# Altium project MCH_MAIN.PrjPcb (part 4 of 7)

## Sheet MB_main_FPGA.SchDoc
size A1
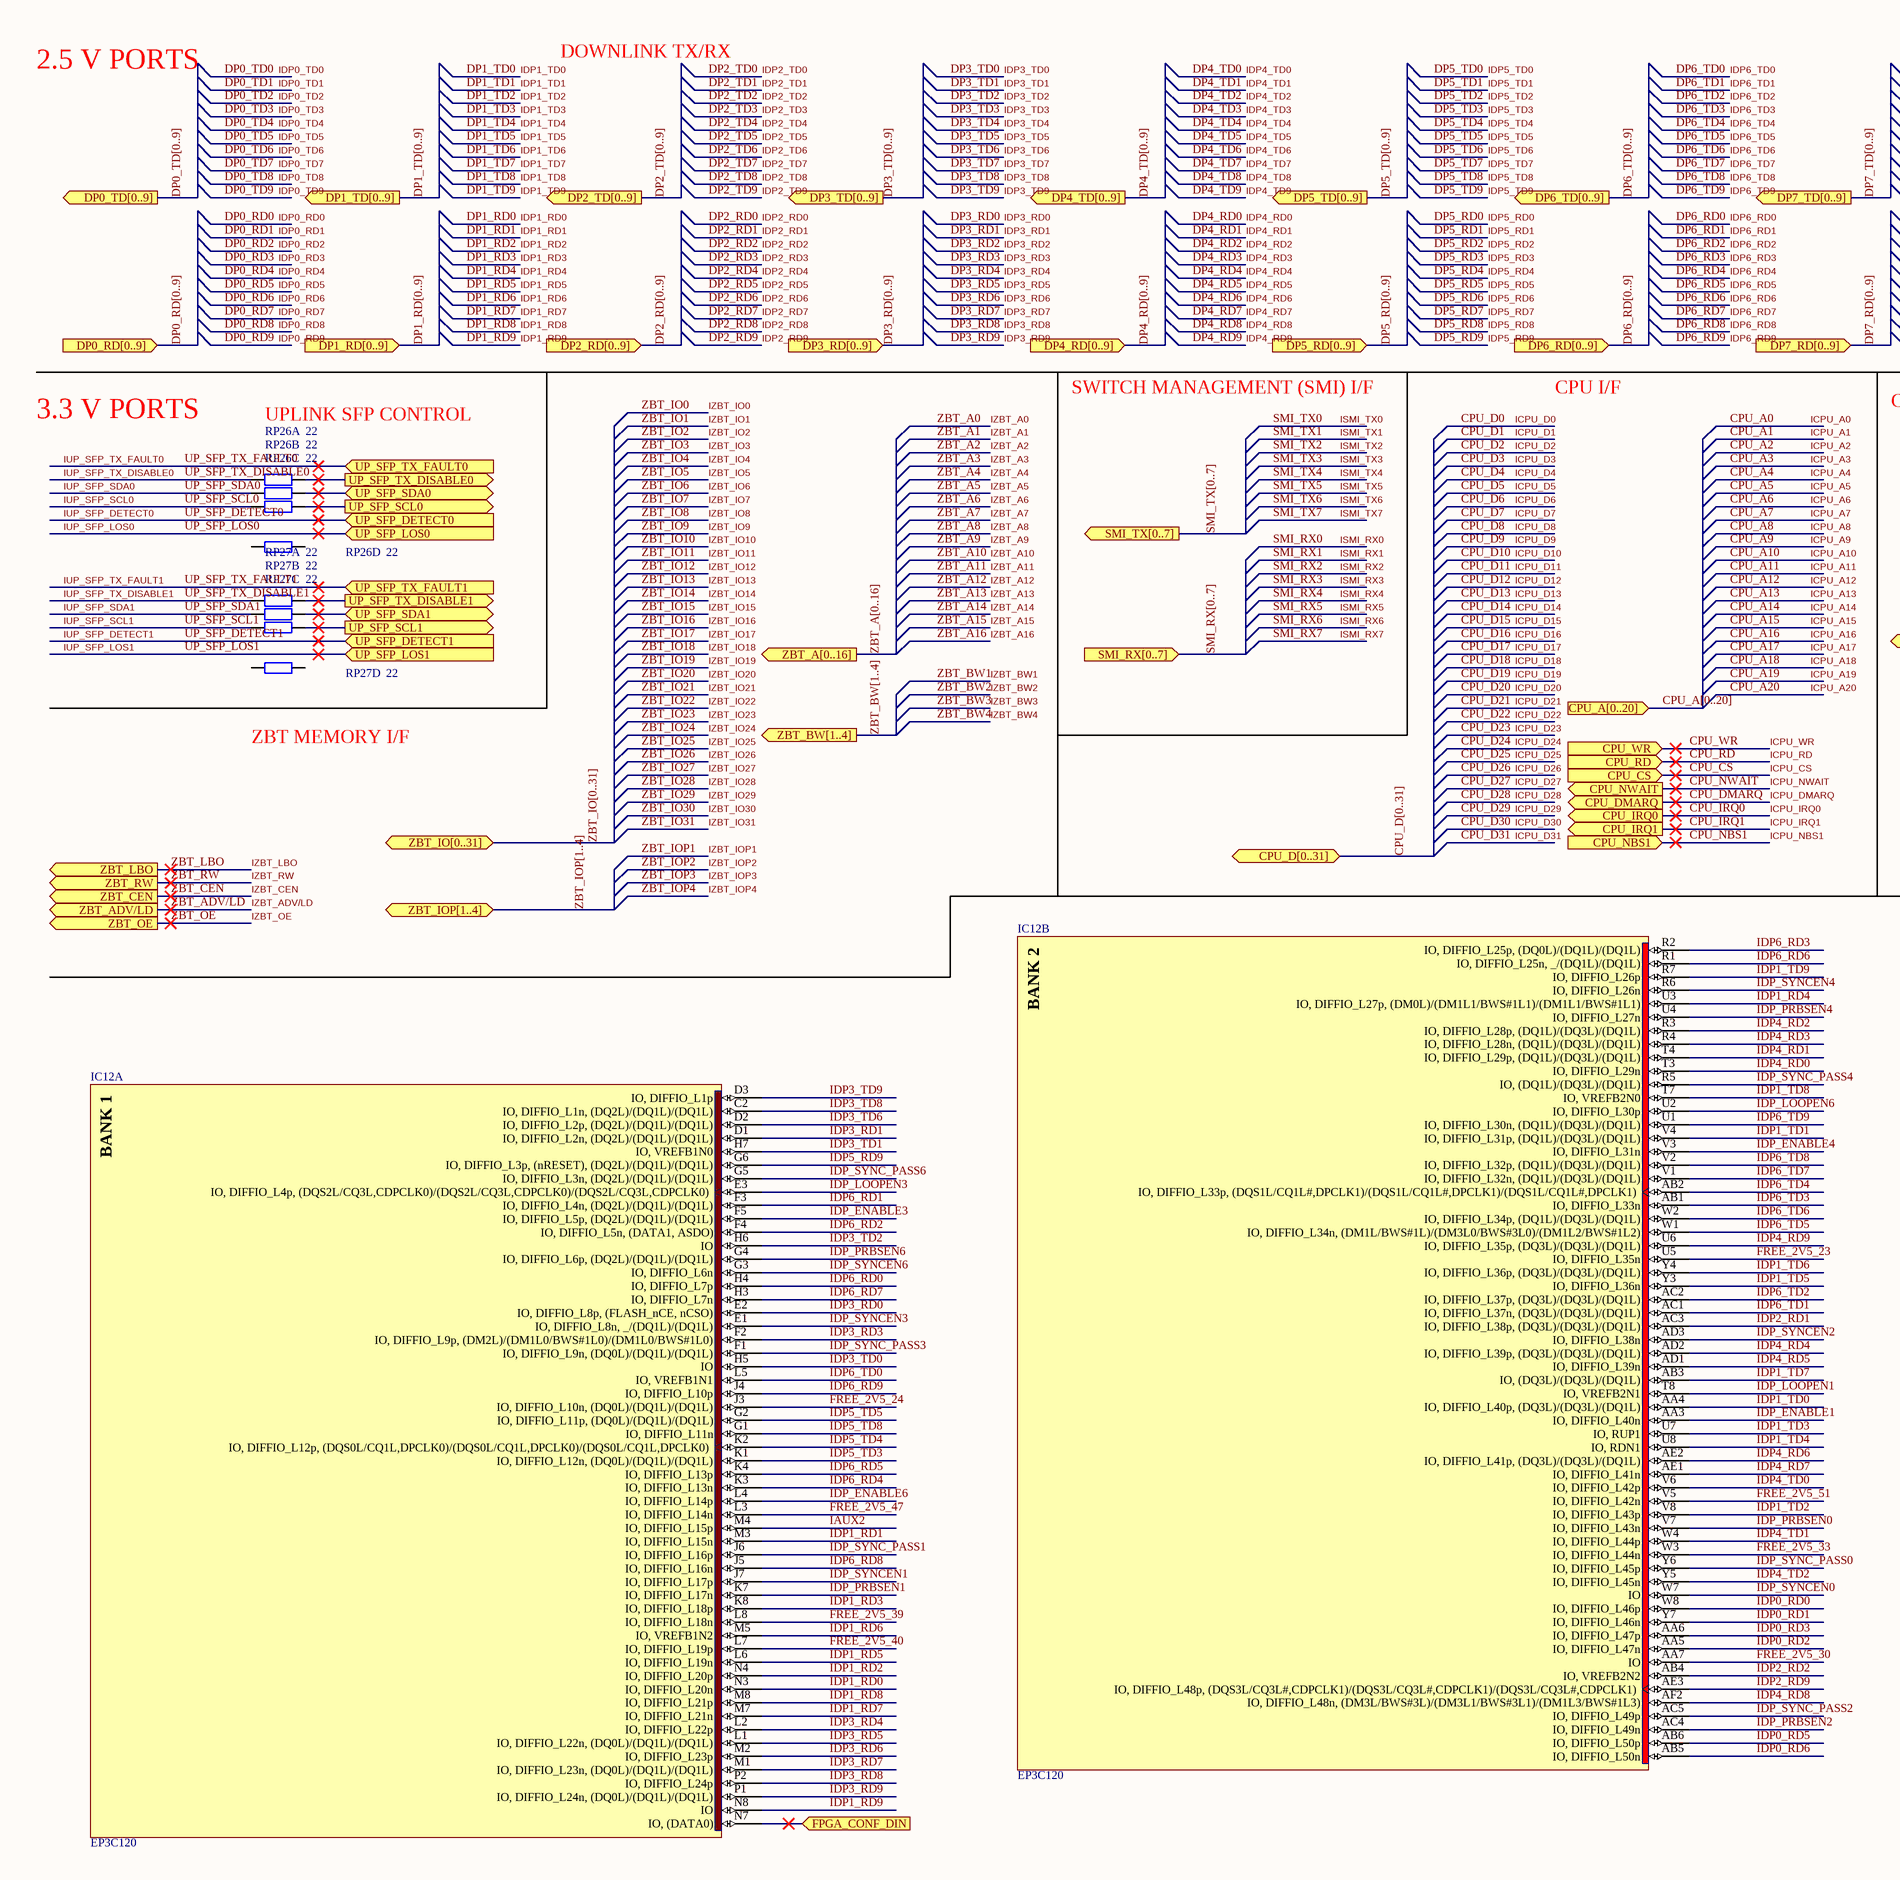
[diagram p8: MB_main_FPGA.SchDoc, top left]
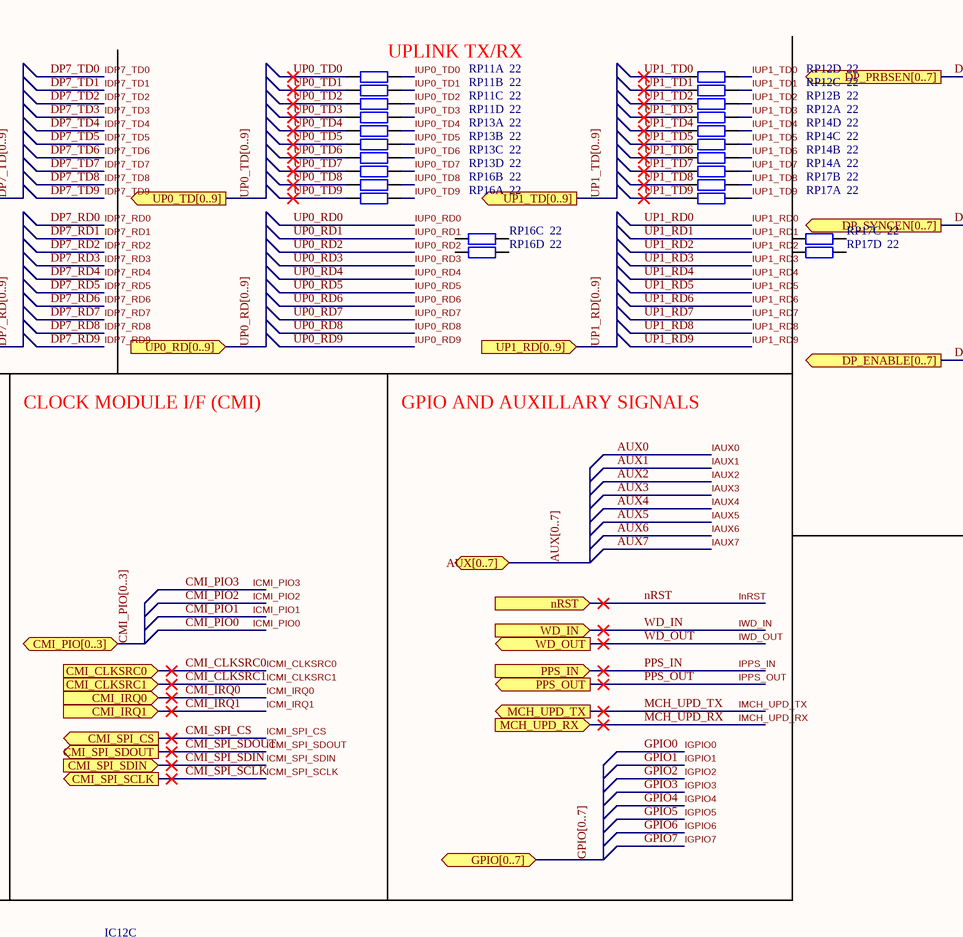
[diagram p9: MB_main_FPGA.SchDoc, top middle]
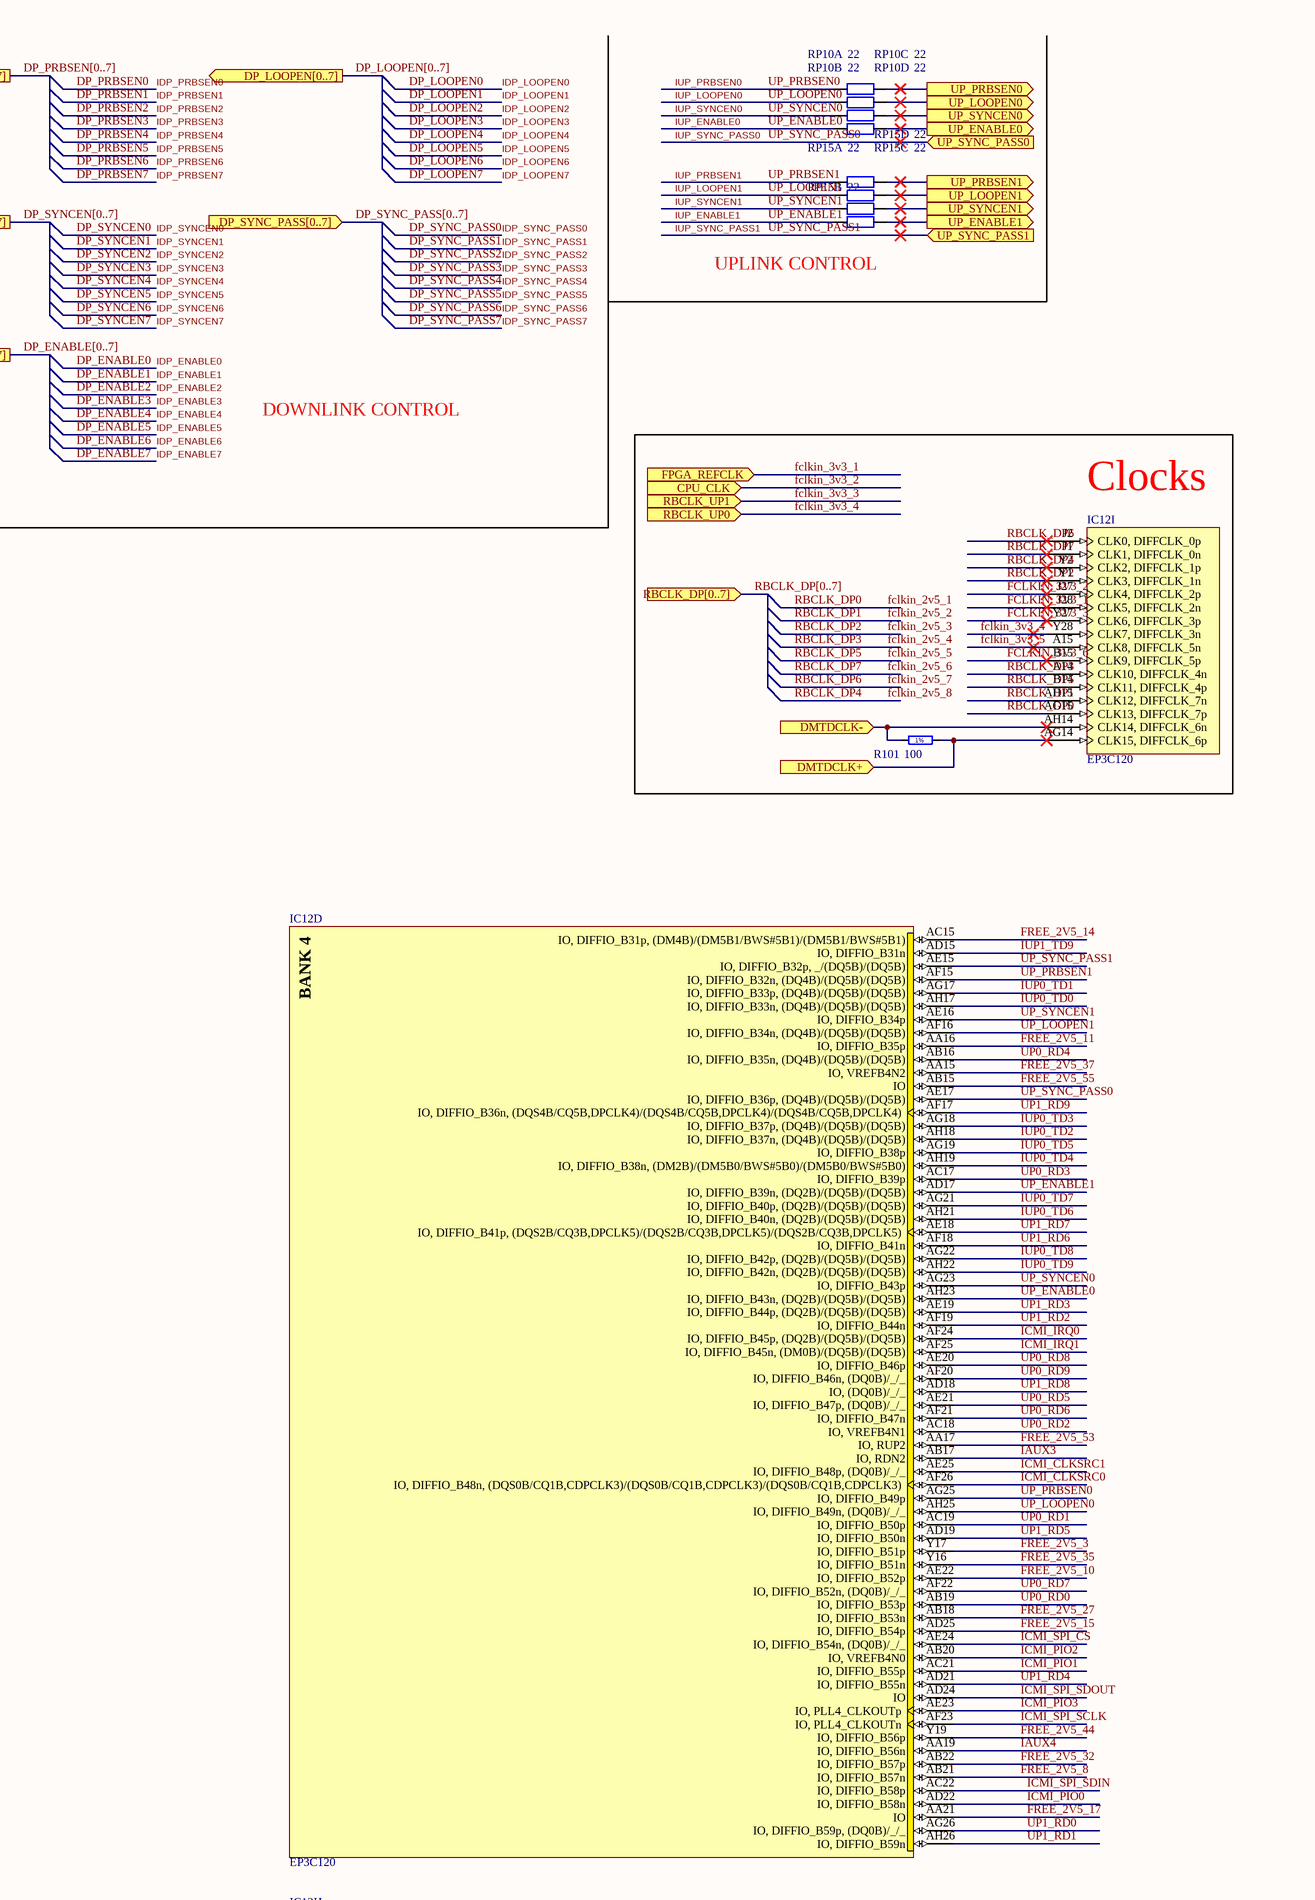
[diagram p10: MB_main_FPGA.SchDoc, top right]
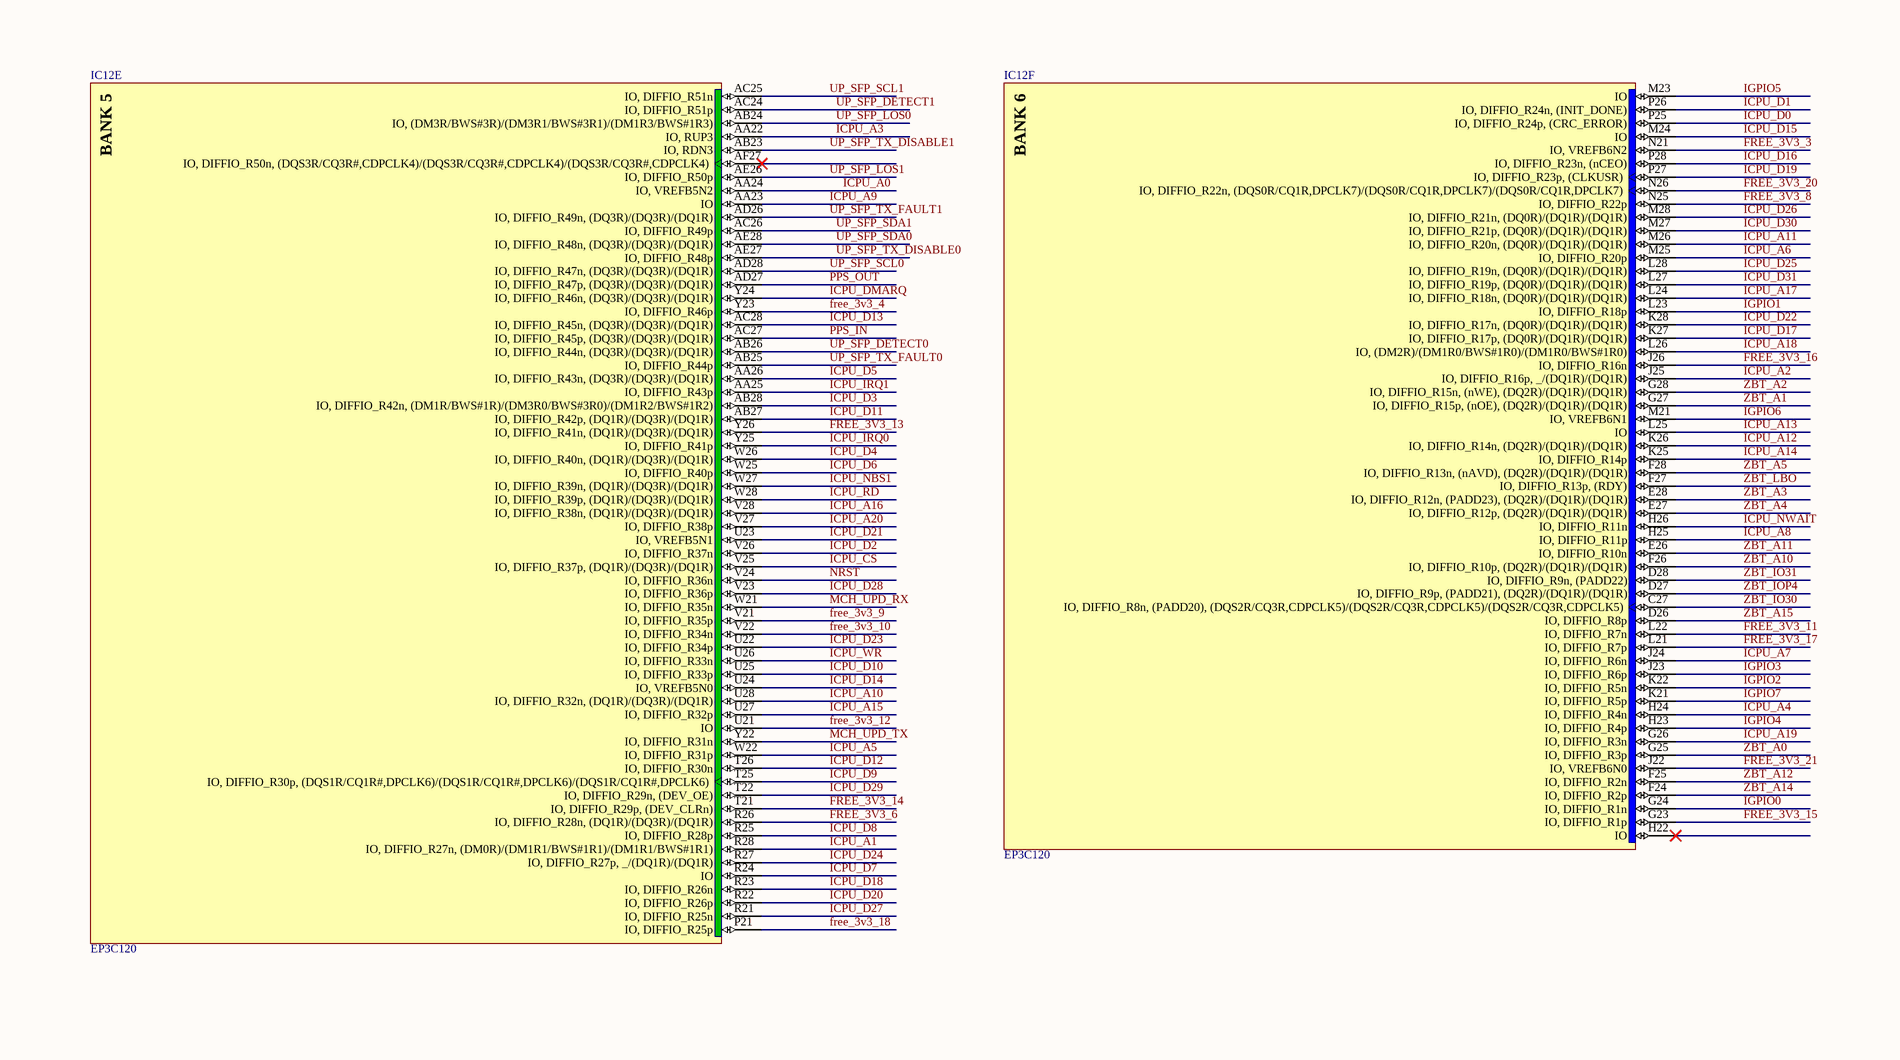
[diagram p11: MB_main_FPGA.SchDoc, bottom left]
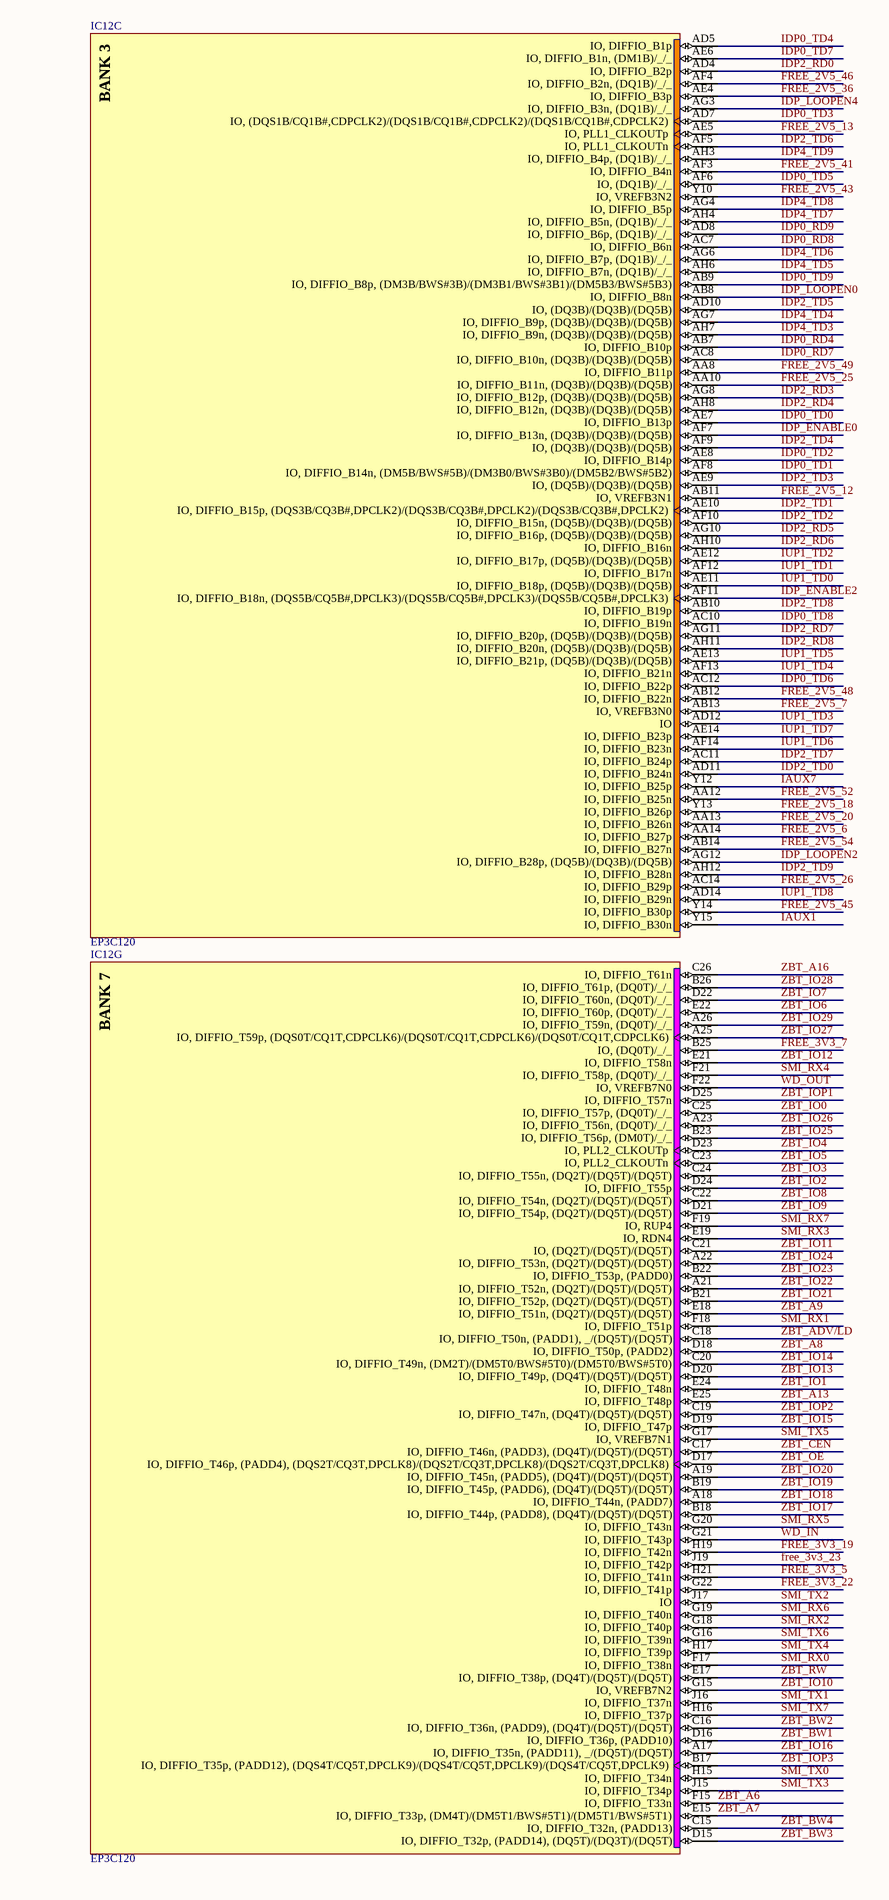
[diagram p12: MB_main_FPGA.SchDoc, bottom middle]
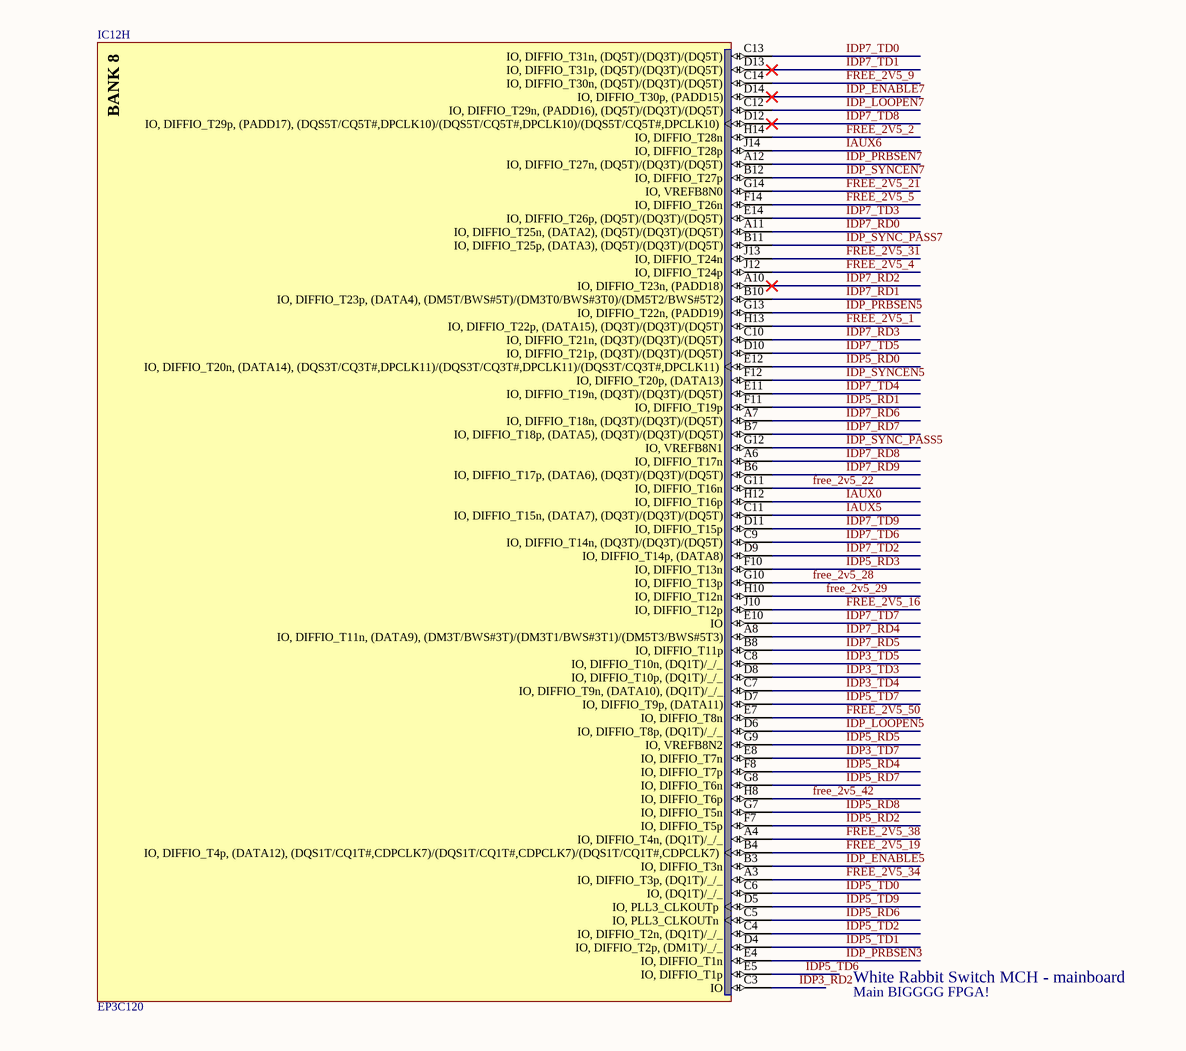
[diagram p13: MB_main_FPGA.SchDoc, bottom right]

### Parts
IC12  EP3C120  [FBGA780-2]  (parts A,B,C,D,E,F,G,H,I of 13)
R101  100  [RESC1005X40N]
RP10  value 22  [YC124]  (hidden comment: RES_PACK)  (parts A,B,C,D of 4)
RP11  value 22  [YC124]  (hidden comment: RES_PACK)  (parts A,B,C,D of 4)
RP12  value 22  [YC124]  (hidden comment: RES_PACK)  (parts A,B,C,D of 4)
RP13  value 22  [YC124]  (hidden comment: RES_PACK)  (parts A,B,C,D of 4)
RP14  value 22  [YC124]  (hidden comment: RES_PACK)  (parts A,B,C,D of 4)
RP15  value 22  [YC124]  (hidden comment: RES_PACK)  (parts A,B,C,D of 4)
RP16  value 22  [YC124]  (hidden comment: RES_PACK)  (parts A,B,C,D of 4)
RP17  value 22  [YC124]  (hidden comment: RES_PACK)  (parts A,B,C,D of 4)
RP26  value 22  [YC124]  (hidden comment: RES_PACK)  (parts A,B,C,D of 4)
RP27  value 22  [YC124]  (hidden comment: RES_PACK)  (parts A,B,C,D of 4)

### Blocks framed on the sheet
Clocks: IC12 R101

### Ports
AUX[0..7] (bidir), CMI_CLKSRC0 (in), CMI_CLKSRC1 (in), CMI_IRQ0 (in), CMI_IRQ1 (in), CMI_PIO[0..3] (bidir), CMI_SPI_CS (out), CMI_SPI_SCLK (out), CMI_SPI_SDIN (in), CMI_SPI_SDOUT (out), CPU_A[0..20] (in), CPU_CLK (in), CPU_CS (in), CPU_D[0..31] (bidir), CPU_DMARQ (out), CPU_IRQ0 (out), CPU_IRQ1 (out), CPU_NBS1 (in), CPU_NWAIT (out), CPU_RD (in), CPU_WR (in), DMTDCLK+ (in), DMTDCLK- (in), DP0_RD[0..9] (in), DP0_TD[0..9] (out), DP1_RD[0..9] (in), DP1_TD[0..9] (out), DP2_RD[0..9] (in), DP2_TD[0..9] (out), DP3_RD[0..9] (in), DP3_TD[0..9] (out), DP4_RD[0..9] (in), DP4_TD[0..9] (out), DP5_RD[0..9] (in), DP5_TD[0..9] (out), DP6_RD[0..9] (in), DP6_TD[0..9] (out), DP7_RD[0..9] (in), DP7_TD[0..9] (out), DP_ENABLE[0..7] (out), DP_LOOPEN[0..7] (out), DP_PRBSEN[0..7] (out), DP_SYNC_PASS[0..7] (in), DP_SYNCEN[0..7] (out), FPGA_CONF_DIN (in), FPGA_REFCLK (in), GPIO[0..7] (bidir), MCH_UPD_RX (in), MCH_UPD_TX (out), nRST (in), PPS_IN (in), PPS_OUT (out), RBCLK_DP[0..7] (in), RBCLK_UP0 (in), RBCLK_UP1 (in), SMI_RX[0..7] (in), SMI_TX[0..7] (out), UP0_RD[0..9] (in), UP0_TD[0..9] (out), UP1_RD[0..9] (in), UP1_TD[0..9] (out), UP_ENABLE0 (out), UP_ENABLE1 (out), UP_LOOPEN0 (out), UP_LOOPEN1 (out), UP_PRBSEN0 (out), UP_PRBSEN1 (out), UP_SFP_DETECT0 (in), UP_SFP_DETECT1 (in), UP_SFP_LOS0 (in), UP_SFP_LOS1 (in), UP_SFP_SCL0 (out), UP_SFP_SCL1 (out), UP_SFP_SDA0 (bidir), UP_SFP_SDA1 (bidir), UP_SFP_TX_DISABLE0 (out), UP_SFP_TX_DISABLE1 (out), UP_SFP_TX_FAULT0 (in), UP_SFP_TX_FAULT1 (in), UP_SYNC_PASS0 (in), UP_SYNC_PASS1 (in), UP_SYNCEN0 (out), UP_SYNCEN1 (out), WD_IN (in), WD_OUT (out), ZBT_A[0..16] (out), ZBT_ADV/LD (out), ZBT_BW[1..4] (out), ZBT_CEN (out), ZBT_IO[0..31] (bidir), ZBT_IOP[1..4] (bidir), ZBT_LBO (out), ZBT_OE (out), ZBT_RW (out)

### Nets
AUX0: IC12.H12(IO,_DIFFIO_T16p)  [also labelled IAUX0]
AUX1: IC12.Y15(IO,_DIFFIO_B30n)  [also labelled IAUX1]
AUX2: IC12.M4(IO,_DIFFIO_L15p)  [also labelled IAUX2]
AUX3: IC12.AB17(IO,_RDN2)  [also labelled IAUX3]
AUX4: IC12.AA19(IO,_DIFFIO_B56n)  [also labelled IAUX4]
AUX5: IC12.C11(IO,_DIFFIO_T15n,_(DATA7),_(DQ3T)/(DQ3T)/(DQ5T))  [also labelled IAUX5]
AUX6: IC12.J14(IO,_DIFFIO_T28p)  [also labelled IAUX6]
AUX7: IC12.Y12(IO,_DIFFIO_B25p)  [also labelled IAUX7]
CMI_CLKSRC0: IC12.AF26(IO,_DIFFIO_B48n,_(DQS0B/CQ1B,CDPCLK3)/(DQS0B/CQ1B,CDPCLK3)/(DQS0B/CQ1B,CDPCLK3)) ; port CMI_CLKSRC0  [also labelled ICMI_CLKSRC0]
CMI_CLKSRC1: IC12.AE25(IO,_DIFFIO_B48p,_(DQ0B)/_/_) ; port CMI_CLKSRC1  [also labelled ICMI_CLKSRC1]
CMI_IRQ0: IC12.AF24(IO,_DIFFIO_B45p,_(DQ2B)/(DQ5B)/(DQ5B)) ; port CMI_IRQ0  [also labelled ICMI_IRQ0]
CMI_IRQ1: IC12.AF25(IO,_DIFFIO_B45n,_(DM0B)/(DQ5B)/(DQ5B)) ; port CMI_IRQ1  [also labelled ICMI_IRQ1]
CMI_PIO0: IC12.AD22(IO,_DIFFIO_B58n)  [also labelled ICMI_PIO0]
CMI_PIO1: IC12.AC21(IO,_DIFFIO_B55p)  [also labelled ICMI_PIO1]
CMI_PIO2: IC12.AB20(IO,_VREFB4N0)  [also labelled ICMI_PIO2]
CMI_PIO3: IC12.AE23(IO,_PLL4_CLKOUTp)  [also labelled ICMI_PIO3]
CMI_SPI_CS: IC12.AE24(IO,_DIFFIO_B54n,_(DQ0B)/_/_) ; port CMI_SPI_CS  [also labelled ICMI_SPI_CS]
CMI_SPI_SCLK: IC12.AF23(IO,_PLL4_CLKOUTn) ; port CMI_SPI_SCLK  [also labelled ICMI_SPI_SCLK]
CMI_SPI_SDIN: IC12.AC22(IO,_DIFFIO_B58p) ; port CMI_SPI_SDIN  [also labelled ICMI_SPI_SDIN]
CMI_SPI_SDOUT: IC12.AD24(IO) ; port CMI_SPI_SDOUT  [also labelled ICMI_SPI_SDOUT]
CPU_A0: IC12.AA24(IO,_VREFB5N2)  [also labelled ICPU_A0]
CPU_A1: IC12.R28(IO,_DIFFIO_R27n,_(DM0R)/(DM1R1/BWS#1R1)/(DM1R1/BWS#1R1))  [also labelled ICPU_A1]
CPU_A2: IC12.J25(IO,_DIFFIO_R16p,__/(DQ1R)/(DQ1R))  [also labelled ICPU_A2]
CPU_A3: IC12.AA22(IO,_RUP3)  [also labelled ICPU_A3]
CPU_A4: IC12.H24(IO,_DIFFIO_R4n)  [also labelled ICPU_A4]
CPU_A5: IC12.W22(IO,_DIFFIO_R31p)  [also labelled ICPU_A5]
CPU_A6: IC12.M25(IO,_DIFFIO_R20p)  [also labelled ICPU_A6]
CPU_A7: IC12.J24(IO,_DIFFIO_R6n)  [also labelled ICPU_A7]
CPU_A8: IC12.H25(IO,_DIFFIO_R11p)  [also labelled ICPU_A8]
CPU_A9: IC12.AA23(IO)  [also labelled ICPU_A9]
CPU_A10: IC12.U28(IO,_DIFFIO_R32n,_(DQ1R)/(DQ3R)/(DQ1R))  [also labelled ICPU_A10]
CPU_A11: IC12.M26(IO,_DIFFIO_R20n,_(DQ0R)/(DQ1R)/(DQ1R))  [also labelled ICPU_A11]
CPU_A12: IC12.K26(IO,_DIFFIO_R14n,_(DQ2R)/(DQ1R)/(DQ1R))  [also labelled ICPU_A12]
CPU_A13: IC12.L25(IO)  [also labelled ICPU_A13]
CPU_A14: IC12.K25(IO,_DIFFIO_R14p)  [also labelled ICPU_A14]
CPU_A15: IC12.U27(IO,_DIFFIO_R32p)  [also labelled ICPU_A15]
CPU_A16: IC12.V28(IO,_DIFFIO_R38n,_(DQ1R)/(DQ3R)/(DQ1R))  [also labelled ICPU_A16]
CPU_A17: IC12.L24(IO,_DIFFIO_R18n,_(DQ0R)/(DQ1R)/(DQ1R))  [also labelled ICPU_A17]
CPU_A18: IC12.L26(IO,_(DM2R)/(DM1R0/BWS#1R0)/(DM1R0/BWS#1R0))  [also labelled ICPU_A18]
CPU_A19: IC12.G26(IO,_DIFFIO_R3n)  [also labelled ICPU_A19]
CPU_A20: IC12.V27(IO,_DIFFIO_R38p)  [also labelled ICPU_A20]
CPU_CS: IC12.V25(IO,_DIFFIO_R37p,_(DQ1R)/(DQ3R)/(DQ1R)) ; port CPU_CS  [also labelled ICPU_CS]
CPU_D0: IC12.P25(IO,_DIFFIO_R24p,_(CRC_ERROR))  [also labelled ICPU_D0]
CPU_D1: IC12.P26(IO,_DIFFIO_R24n,_(INIT_DONE))  [also labelled ICPU_D1]
CPU_D2: IC12.V26(IO,_DIFFIO_R37n)  [also labelled ICPU_D2]
CPU_D3: IC12.AB28(IO,_DIFFIO_R42n,_(DM1R/BWS#1R)/(DM3R0/BWS#3R0)/(DM1R2/BWS#1R2))  [also labelled ICPU_D3]
CPU_D4: IC12.W26(IO,_DIFFIO_R40n,_(DQ1R)/(DQ3R)/(DQ1R))  [also labelled ICPU_D4]
CPU_D5: IC12.AA26(IO,_DIFFIO_R43n,_(DQ3R)/(DQ3R)/(DQ1R))  [also labelled ICPU_D5]
CPU_D6: IC12.W25(IO,_DIFFIO_R40p)  [also labelled ICPU_D6]
CPU_D7: IC12.R24(IO)  [also labelled ICPU_D7]
CPU_D8: IC12.R25(IO,_DIFFIO_R28p)  [also labelled ICPU_D8]
CPU_D9: IC12.T25(IO,_DIFFIO_R30p,_(DQS1R/CQ1R#,DPCLK6)/(DQS1R/CQ1R#,DPCLK6)/(DQS1R/CQ1R#,DPCLK6))  [also labelled ICPU_D9]
CPU_D10: IC12.U25(IO,_DIFFIO_R33p)  [also labelled ICPU_D10]
CPU_D11: IC12.AB27(IO,_DIFFIO_R42p,_(DQ1R)/(DQ3R)/(DQ1R))  [also labelled ICPU_D11]
CPU_D12: IC12.T26(IO,_DIFFIO_R30n)  [also labelled ICPU_D12]
CPU_D13: IC12.AC28(IO,_DIFFIO_R45n,_(DQ3R)/(DQ3R)/(DQ1R))  [also labelled ICPU_D13]
CPU_D14: IC12.U24(IO,_VREFB5N0)  [also labelled ICPU_D14]
CPU_D15: IC12.M24(IO)  [also labelled ICPU_D15]
CPU_D16: IC12.P28(IO,_DIFFIO_R23n,_(nCEO))  [also labelled ICPU_D16]
CPU_D17: IC12.K27(IO,_DIFFIO_R17p,_(DQ0R)/(DQ1R)/(DQ1R))  [also labelled ICPU_D17]
CPU_D18: IC12.R23(IO,_DIFFIO_R26n)  [also labelled ICPU_D18]
CPU_D19: IC12.P27(IO,_DIFFIO_R23p,_(CLKUSR))  [also labelled ICPU_D19]
CPU_D20: IC12.R22(IO,_DIFFIO_R26p)  [also labelled ICPU_D20]
CPU_D21: IC12.U23(IO,_VREFB5N1)  [also labelled ICPU_D21]
CPU_D22: IC12.K28(IO,_DIFFIO_R17n,_(DQ0R)/(DQ1R)/(DQ1R))  [also labelled ICPU_D22]
CPU_D23: IC12.U22(IO,_DIFFIO_R34p)  [also labelled ICPU_D23]
CPU_D24: IC12.R27(IO,_DIFFIO_R27p,__/(DQ1R)/(DQ1R))  [also labelled ICPU_D24]
CPU_D25: IC12.L28(IO,_DIFFIO_R19n,_(DQ0R)/(DQ1R)/(DQ1R))  [also labelled ICPU_D25]
CPU_D26: IC12.M28(IO,_DIFFIO_R21n,_(DQ0R)/(DQ1R)/(DQ1R))  [also labelled ICPU_D26]
CPU_D27: IC12.R21(IO,_DIFFIO_R25n)  [also labelled ICPU_D27]
CPU_D28: IC12.V23(IO,_DIFFIO_R36p)  [also labelled ICPU_D28]
CPU_D29: IC12.T22(IO,_DIFFIO_R29n,_(DEV_OE))  [also labelled ICPU_D29]
CPU_D30: IC12.M27(IO,_DIFFIO_R21p,_(DQ0R)/(DQ1R)/(DQ1R))  [also labelled ICPU_D30]
CPU_D31: IC12.L27(IO,_DIFFIO_R19p,_(DQ0R)/(DQ1R)/(DQ1R))  [also labelled ICPU_D31]
CPU_DMARQ: IC12.Y24(IO,_DIFFIO_R46n,_(DQ3R)/(DQ3R)/(DQ1R)) ; port CPU_DMARQ  [also labelled ICPU_DMARQ]
CPU_IRQ0: IC12.Y25(IO,_DIFFIO_R41p) ; port CPU_IRQ0  [also labelled ICPU_IRQ0]
CPU_IRQ1: IC12.AA25(IO,_DIFFIO_R43p) ; port CPU_IRQ1  [also labelled ICPU_IRQ1]
CPU_NBS1: IC12.W27(IO,_DIFFIO_R39n,_(DQ1R)/(DQ3R)/(DQ1R)) ; port CPU_NBS1  [also labelled ICPU_NBS1]
CPU_NWAIT: IC12.H26(IO,_DIFFIO_R11n) ; port CPU_NWAIT  [also labelled ICPU_NWAIT]
CPU_RD: IC12.W28(IO,_DIFFIO_R39p,_(DQ1R)/(DQ3R)/(DQ1R)) ; port CPU_RD  [also labelled ICPU_RD]
CPU_WR: IC12.U26(IO,_DIFFIO_R33n) ; port CPU_WR  [also labelled ICPU_WR]
DMTDCLK_MAIN+: IC12.AG14(CLK15,_DIFFCLK_6p) R101.2 ; port DMTDCLK+
DMTDCLK_MAIN-: IC12.AH14(CLK14,_DIFFCLK_6n) R101.1 ; port DMTDCLK-
DP0_RD0: IC12.W8(IO,_DIFFIO_L46p)  [also labelled IDP0_RD0]
DP0_RD1: IC12.Y7(IO,_DIFFIO_L46n)  [also labelled IDP0_RD1]
DP0_RD2: IC12.AA5(IO,_DIFFIO_L47n)  [also labelled IDP0_RD2]
DP0_RD3: IC12.AA6(IO,_DIFFIO_L47p)  [also labelled IDP0_RD3]
DP0_RD4: IC12.AB7(IO,_DIFFIO_B10p)  [also labelled IDP0_RD4]
DP0_RD5: IC12.AB6(IO,_DIFFIO_L50p)  [also labelled IDP0_RD5]
DP0_RD6: IC12.AB5(IO,_DIFFIO_L50n)  [also labelled IDP0_RD6]
DP0_RD7: IC12.AC8(IO,_DIFFIO_B10n,_(DQ3B)/(DQ3B)/(DQ5B))  [also labelled IDP0_RD7]
DP0_RD8: IC12.AC7(IO,_DIFFIO_B6n)  [also labelled IDP0_RD8]
DP0_RD9: IC12.AD8(IO,_DIFFIO_B6p,_(DQ1B)/_/_)  [also labelled IDP0_RD9]
DP0_TD0: IC12.AE7(IO,_DIFFIO_B13p)  [also labelled IDP0_TD0]
DP0_TD1: IC12.AF8(IO,_DIFFIO_B14n,_(DM5B/BWS#5B)/(DM3B0/BWS#3B0)/(DM5B2/BWS#5B2))  [also labelled IDP0_TD1]
DP0_TD2: IC12.AE8(IO,_DIFFIO_B14p)  [also labelled IDP0_TD2]
DP0_TD3: IC12.AD7(IO,_(DQS1B/CQ1B#,CDPCLK2)/(DQS1B/CQ1B#,CDPCLK2)/(DQS1B/CQ1B#,CDPCLK2))  [also labelled IDP0_TD3]
DP0_TD4: IC12.AD5(IO,_DIFFIO_B1p)  [also labelled IDP0_TD4]
DP0_TD5: IC12.AF6(IO,_(DQ1B)/_/_)  [also labelled IDP0_TD5]
DP0_TD6: IC12.AC12(IO,_DIFFIO_B22p)  [also labelled IDP0_TD6]
DP0_TD7: IC12.AE6(IO,_DIFFIO_B1n,_(DM1B)/_/_)  [also labelled IDP0_TD7]
DP0_TD8: IC12.AC10(IO,_DIFFIO_B19n)  [also labelled IDP0_TD8]
DP0_TD9: IC12.AB9(IO,_DIFFIO_B8p,_(DM3B/BWS#3B)/(DM3B1/BWS#3B1)/(DM5B3/BWS#5B3))  [also labelled IDP0_TD9]
DP1_RD0: IC12.N3(IO,_DIFFIO_L20n)  [also labelled IDP1_RD0]
DP1_RD1: IC12.M3(IO,_DIFFIO_L15n)  [also labelled IDP1_RD1]
DP1_RD2: IC12.N4(IO,_DIFFIO_L20p)  [also labelled IDP1_RD2]
DP1_RD3: IC12.K8(IO,_DIFFIO_L18p)  [also labelled IDP1_RD3]
DP1_RD4: IC12.U3(IO,_DIFFIO_L27p,_(DM0L)/(DM1L1/BWS#1L1)/(DM1L1/BWS#1L1))  [also labelled IDP1_RD4]
DP1_RD5: IC12.L6(IO,_DIFFIO_L19n)  [also labelled IDP1_RD5]
DP1_RD6: IC12.M5(IO,_VREFB1N2)  [also labelled IDP1_RD6]
DP1_RD7: IC12.M7(IO,_DIFFIO_L21n)  [also labelled IDP1_RD7]
DP1_RD8: IC12.M8(IO,_DIFFIO_L21p)  [also labelled IDP1_RD8]
DP1_RD9: IC12.N8(IO)  [also labelled IDP1_RD9]
DP1_TD0: IC12.AA4(IO,_DIFFIO_L40p,_(DQ3L)/(DQ3L)/(DQ1L))  [also labelled IDP1_TD0]
DP1_TD1: IC12.V4(IO,_DIFFIO_L31p,_(DQ1L)/(DQ3L)/(DQ1L))  [also labelled IDP1_TD1]
DP1_TD2: IC12.V8(IO,_DIFFIO_L43p)  [also labelled IDP1_TD2]
DP1_TD3: IC12.U7(IO,_RUP1)  [also labelled IDP1_TD3]
DP1_TD4: IC12.U8(IO,_RDN1)  [also labelled IDP1_TD4]
DP1_TD5: IC12.Y3(IO,_DIFFIO_L36n)  [also labelled IDP1_TD5]
DP1_TD6: IC12.Y4(IO,_DIFFIO_L36p,_(DQ3L)/(DQ3L)/(DQ1L))  [also labelled IDP1_TD6]
DP1_TD7: IC12.AB3(IO,_(DQ3L)/(DQ3L)/(DQ1L))  [also labelled IDP1_TD7]
DP1_TD8: IC12.T7(IO,_VREFB2N0)  [also labelled IDP1_TD8]
DP1_TD9: IC12.R7(IO,_DIFFIO_L26p)  [also labelled IDP1_TD9]
DP2_RD0: IC12.AD4(IO,_DIFFIO_B2p)  [also labelled IDP2_RD0]
DP2_RD1: IC12.AC3(IO,_DIFFIO_L38p,_(DQ3L)/(DQ3L)/(DQ1L))  [also labelled IDP2_RD1]
DP2_RD2: IC12.AB4(IO,_VREFB2N2)  [also labelled IDP2_RD2]
DP2_RD3: IC12.AG8(IO,_DIFFIO_B12p,_(DQ3B)/(DQ3B)/(DQ5B))  [also labelled IDP2_RD3]
DP2_RD4: IC12.AH8(IO,_DIFFIO_B12n,_(DQ3B)/(DQ3B)/(DQ5B))  [also labelled IDP2_RD4]
DP2_RD5: IC12.AG10(IO,_DIFFIO_B16p,_(DQ5B)/(DQ3B)/(DQ5B))  [also labelled IDP2_RD5]
DP2_RD6: IC12.AH10(IO,_DIFFIO_B16n)  [also labelled IDP2_RD6]
DP2_RD7: IC12.AG11(IO,_DIFFIO_B20p,_(DQ5B)/(DQ3B)/(DQ5B))  [also labelled IDP2_RD7]
DP2_RD8: IC12.AH11(IO,_DIFFIO_B20n,_(DQ5B)/(DQ3B)/(DQ5B))  [also labelled IDP2_RD8]
DP2_RD9: IC12.AE3(IO,_DIFFIO_L48p,_(DQS3L/CQ3L#,CDPCLK1)/(DQS3L/CQ3L#,CDPCLK1)/(DQS3L/CQ3L#,CDPCLK1))  [also labelled IDP2_RD9]
DP2_TD0: IC12.AD11(IO,_DIFFIO_B24n)  [also labelled IDP2_TD0]
DP2_TD1: IC12.AE10(IO,_DIFFIO_B15p,_(DQS3B/CQ3B#,DPCLK2)/(DQS3B/CQ3B#,DPCLK2)/(DQS3B/CQ3B#,DPCLK2))  [also labelled IDP2_TD1]
DP2_TD2: IC12.AF10(IO,_DIFFIO_B15n,_(DQ5B)/(DQ3B)/(DQ5B))  [also labelled IDP2_TD2]
DP2_TD3: IC12.AE9(IO,_(DQ5B)/(DQ3B)/(DQ5B))  [also labelled IDP2_TD3]
DP2_TD4: IC12.AF9(IO,_(DQ3B)/(DQ3B)/(DQ5B))  [also labelled IDP2_TD4]
DP2_TD5: IC12.AD10(IO,_(DQ3B)/(DQ3B)/(DQ5B))  [also labelled IDP2_TD5]
DP2_TD6: IC12.AF5(IO,_PLL1_CLKOUTn)  [also labelled IDP2_TD6]
DP2_TD7: IC12.AC11(IO,_DIFFIO_B24p)  [also labelled IDP2_TD7]
DP2_TD8: IC12.AB10(IO,_DIFFIO_B19p)  [also labelled IDP2_TD8]
DP2_TD9: IC12.AH12(IO,_DIFFIO_B28n)  [also labelled IDP2_TD9]
DP3_RD0: IC12.E2(IO,_DIFFIO_L8p,_(FLASH_nCE,_nCSO))  [also labelled IDP3_RD0]
DP3_RD1: IC12.D1(IO,_DIFFIO_L2n,_(DQ2L)/(DQ1L)/(DQ1L))  [also labelled IDP3_RD1]
DP3_RD2: IC12.C3(IO)  [also labelled IDP3_RD2]
DP3_RD3: IC12.F2(IO,_DIFFIO_L9p,_(DM2L)/(DM1L0/BWS#1L0)/(DM1L0/BWS#1L0))  [also labelled IDP3_RD3]
DP3_RD4: IC12.L2(IO,_DIFFIO_L22p)  [also labelled IDP3_RD4]
DP3_RD5: IC12.L1(IO,_DIFFIO_L22n,_(DQ0L)/(DQ1L)/(DQ1L))  [also labelled IDP3_RD5]
DP3_RD6: IC12.M2(IO,_DIFFIO_L23p)  [also labelled IDP3_RD6]
DP3_RD7: IC12.M1(IO,_DIFFIO_L23n,_(DQ0L)/(DQ1L)/(DQ1L))  [also labelled IDP3_RD7]
DP3_RD8: IC12.P2(IO,_DIFFIO_L24p)  [also labelled IDP3_RD8]
DP3_RD9: IC12.P1(IO,_DIFFIO_L24n,_(DQ0L)/(DQ1L)/(DQ1L))  [also labelled IDP3_RD9]
DP3_TD0: IC12.H5(IO)  [also labelled IDP3_TD0]
DP3_TD1: IC12.H7(IO,_VREFB1N0)  [also labelled IDP3_TD1]
DP3_TD2: IC12.H6(IO)  [also labelled IDP3_TD2]
DP3_TD3: IC12.D8(IO,_DIFFIO_T10p,_(DQ1T)/_/_)  [also labelled IDP3_TD3]
DP3_TD4: IC12.C7(IO,_DIFFIO_T9n,_(DATA10),_(DQ1T)/_/_)  [also labelled IDP3_TD4]
DP3_TD5: IC12.C8(IO,_DIFFIO_T10n,_(DQ1T)/_/_)  [also labelled IDP3_TD5]
DP3_TD6: IC12.D2(IO,_DIFFIO_L2p,_(DQ2L)/(DQ1L)/(DQ1L))  [also labelled IDP3_TD6]
DP3_TD7: IC12.E8(IO,_DIFFIO_T7n)  [also labelled IDP3_TD7]
DP3_TD8: IC12.C2(IO,_DIFFIO_L1n,_(DQ2L)/(DQ1L)/(DQ1L))  [also labelled IDP3_TD8]
DP3_TD9: IC12.D3(IO,_DIFFIO_L1p)  [also labelled IDP3_TD9]
DP4_RD0: IC12.T3(IO,_DIFFIO_L29n)  [also labelled IDP4_RD0]
DP4_RD1: IC12.T4(IO,_DIFFIO_L29p,_(DQ1L)/(DQ3L)/(DQ1L))  [also labelled IDP4_RD1]
DP4_RD2: IC12.R3(IO,_DIFFIO_L28p,_(DQ1L)/(DQ3L)/(DQ1L))  [also labelled IDP4_RD2]
DP4_RD3: IC12.R4(IO,_DIFFIO_L28n,_(DQ1L)/(DQ3L)/(DQ1L))  [also labelled IDP4_RD3]
DP4_RD4: IC12.AD2(IO,_DIFFIO_L39p,_(DQ3L)/(DQ3L)/(DQ1L))  [also labelled IDP4_RD4]
DP4_RD5: IC12.AD1(IO,_DIFFIO_L39n)  [also labelled IDP4_RD5]
DP4_RD6: IC12.AE2(IO,_DIFFIO_L41p,_(DQ3L)/(DQ3L)/(DQ1L))  [also labelled IDP4_RD6]
DP4_RD7: IC12.AE1(IO,_DIFFIO_L41n)  [also labelled IDP4_RD7]
DP4_RD8: IC12.AF2(IO,_DIFFIO_L48n,_(DM3L/BWS#3L)/(DM3L1/BWS#3L1)/(DM1L3/BWS#1L3))  [also labelled IDP4_RD8]
DP4_RD9: IC12.U6(IO,_DIFFIO_L35p,_(DQ3L)/(DQ3L)/(DQ1L))  [also labelled IDP4_RD9]
DP4_TD0: IC12.V6(IO,_DIFFIO_L42p)  [also labelled IDP4_TD0]
DP4_TD1: IC12.W4(IO,_DIFFIO_L44p)  [also labelled IDP4_TD1]
DP4_TD2: IC12.Y5(IO,_DIFFIO_L45n)  [also labelled IDP4_TD2]
DP4_TD3: IC12.AH7(IO,_DIFFIO_B9n,_(DQ3B)/(DQ3B)/(DQ5B))  [also labelled IDP4_TD3]
DP4_TD4: IC12.AG7(IO,_DIFFIO_B9p,_(DQ3B)/(DQ3B)/(DQ5B))  [also labelled IDP4_TD4]
DP4_TD5: IC12.AH6(IO,_DIFFIO_B7n,_(DQ1B)/_/_)  [also labelled IDP4_TD5]
DP4_TD6: IC12.AG6(IO,_DIFFIO_B7p,_(DQ1B)/_/_)  [also labelled IDP4_TD6]
DP4_TD7: IC12.AH4(IO,_DIFFIO_B5n,_(DQ1B)/_/_)  [also labelled IDP4_TD7]
DP4_TD8: IC12.AG4(IO,_DIFFIO_B5p)  [also labelled IDP4_TD8]
DP4_TD9: IC12.AH3(IO,_DIFFIO_B4p,_(DQ1B)/_/_)  [also labelled IDP4_TD9]
DP5_RD0: IC12.E12(IO,_DIFFIO_T20n,_(DATA14),_(DQS3T/CQ3T#,DPCLK11)/(DQS3T/CQ3T#,DPCLK11)/(DQS3T/CQ3T#,DPCLK11))  [also labelled IDP5_RD0]
DP5_RD1: IC12.F11(IO,_DIFFIO_T19p)  [also labelled IDP5_RD1]
DP5_RD2: IC12.F7(IO,_DIFFIO_T5p)  [also labelled IDP5_RD2]
DP5_RD3: IC12.F10(IO,_DIFFIO_T13n)  [also labelled IDP5_RD3]
DP5_RD4: IC12.F8(IO,_DIFFIO_T7p)  [also labelled IDP5_RD4]
DP5_RD5: IC12.G9(IO,_VREFB8N2)  [also labelled IDP5_RD5]
DP5_RD6: IC12.C5(IO,_PLL3_CLKOUTn)  [also labelled IDP5_RD6]
DP5_RD7: IC12.G8(IO,_DIFFIO_T6n)  [also labelled IDP5_RD7]
DP5_RD8: IC12.G7(IO,_DIFFIO_T5n)  [also labelled IDP5_RD8]
DP5_RD9: IC12.G6(IO,_DIFFIO_L3p,_(nRESET),_(DQ2L)/(DQ1L)/(DQ1L))  [also labelled IDP5_RD9]
DP5_TD0: IC12.C6(IO,_(DQ1T)/_/_)  [also labelled IDP5_TD0]
DP5_TD1: IC12.D4(IO,_DIFFIO_T2p,_(DM1T)/_/_)  [also labelled IDP5_TD1]
DP5_TD2: IC12.C4(IO,_DIFFIO_T2n,_(DQ1T)/_/_)  [also labelled IDP5_TD2]
DP5_TD3: IC12.K1(IO,_DIFFIO_L12n,_(DQ0L)/(DQ1L)/(DQ1L))  [also labelled IDP5_TD3]
DP5_TD4: IC12.K2(IO,_DIFFIO_L12p,_(DQS0L/CQ1L,DPCLK0)/(DQS0L/CQ1L,DPCLK0)/(DQS0L/CQ1L,DPCLK0))  [also labelled IDP5_TD4]
DP5_TD5: IC12.G2(IO,_DIFFIO_L11p,_(DQ0L)/(DQ1L)/(DQ1L))  [also labelled IDP5_TD5]
DP5_TD6: IC12.E5(IO,_DIFFIO_T1p)  [also labelled IDP5_TD6]
DP5_TD7: IC12.D7(IO,_DIFFIO_T9p,_(DATA11))  [also labelled IDP5_TD7]
DP5_TD8: IC12.G1(IO,_DIFFIO_L11n)  [also labelled IDP5_TD8]
DP5_TD9: IC12.D5(IO,_PLL3_CLKOUTp)  [also labelled IDP5_TD9]
DP6_RD0: IC12.H4(IO,_DIFFIO_L7p)  [also labelled IDP6_RD0]
DP6_RD1: IC12.F3(IO,_DIFFIO_L4n,_(DQ2L)/(DQ1L)/(DQ1L))  [also labelled IDP6_RD1]
DP6_RD2: IC12.F4(IO,_DIFFIO_L5n,_(DATA1,_ASDO))  [also labelled IDP6_RD2]
DP6_RD3: IC12.R2(IO,_DIFFIO_L25p,_(DQ0L)/(DQ1L)/(DQ1L))  [also labelled IDP6_RD3]
DP6_RD4: IC12.K3(IO,_DIFFIO_L13n)  [also labelled IDP6_RD4]
DP6_RD5: IC12.K4(IO,_DIFFIO_L13p)  [also labelled IDP6_RD5]
DP6_RD6: IC12.R1(IO,_DIFFIO_L25n,__/(DQ1L)/(DQ1L))  [also labelled IDP6_RD6]
DP6_RD7: IC12.H3(IO,_DIFFIO_L7n)  [also labelled IDP6_RD7]
DP6_RD8: IC12.J5(IO,_DIFFIO_L16n)  [also labelled IDP6_RD8]
DP6_RD9: IC12.J4(IO,_DIFFIO_L10p)  [also labelled IDP6_RD9]
DP6_TD0: IC12.L5(IO,_VREFB1N1)  [also labelled IDP6_TD0]
DP6_TD1: IC12.AC1(IO,_DIFFIO_L37n,_(DQ3L)/(DQ3L)/(DQ1L))  [also labelled IDP6_TD1]
DP6_TD2: IC12.AC2(IO,_DIFFIO_L37p,_(DQ3L)/(DQ3L)/(DQ1L))  [also labelled IDP6_TD2]
DP6_TD3: IC12.AB1(IO,_DIFFIO_L33n)  [also labelled IDP6_TD3]
DP6_TD4: IC12.AB2(IO,_DIFFIO_L33p,_(DQS1L/CQ1L#,DPCLK1)/(DQS1L/CQ1L#,DPCLK1)/(DQS1L/CQ1L#,DPCLK1))  [also labelled IDP6_TD4]
DP6_TD5: IC12.W1(IO,_DIFFIO_L34n,_(DM1L/BWS#1L)/(DM3L0/BWS#3L0)/(DM1L2/BWS#1L2))  [also labelled IDP6_TD5]
DP6_TD6: IC12.W2(IO,_DIFFIO_L34p,_(DQ1L)/(DQ3L)/(DQ1L))  [also labelled IDP6_TD6]
DP6_TD7: IC12.V1(IO,_DIFFIO_L32n,_(DQ1L)/(DQ3L)/(DQ1L))  [also labelled IDP6_TD7]
DP6_TD8: IC12.V2(IO,_DIFFIO_L32p,_(DQ1L)/(DQ3L)/(DQ1L))  [also labelled IDP6_TD8]
DP6_TD9: IC12.U1(IO,_DIFFIO_L30n,_(DQ1L)/(DQ3L)/(DQ1L))  [also labelled IDP6_TD9]
DP7_RD0: IC12.A11(IO,_DIFFIO_T25n,_(DATA2),_(DQ5T)/(DQ3T)/(DQ5T))  [also labelled IDP7_RD0]
DP7_RD1: IC12.B10(IO,_DIFFIO_T23p,_(DATA4),_(DM5T/BWS#5T)/(DM3T0/BWS#3T0)/(DM5T2/BWS#5T2))  [also labelled IDP7_RD1]
DP7_RD2: IC12.A10(IO,_DIFFIO_T23n,_(PADD18))  [also labelled IDP7_RD2]
DP7_RD3: IC12.C10(IO,_DIFFIO_T21n,_(DQ3T)/(DQ3T)/(DQ5T))  [also labelled IDP7_RD3]
DP7_RD4: IC12.A8(IO,_DIFFIO_T11n,_(DATA9),_(DM3T/BWS#3T)/(DM3T1/BWS#3T1)/(DM5T3/BWS#5T3))  [also labelled IDP7_RD4]
DP7_RD5: IC12.B8(IO,_DIFFIO_T11p)  [also labelled IDP7_RD5]
DP7_RD6: IC12.A7(IO,_DIFFIO_T18n,_(DQ3T)/(DQ3T)/(DQ5T))  [also labelled IDP7_RD6]
DP7_RD7: IC12.B7(IO,_DIFFIO_T18p,_(DATA5),_(DQ3T)/(DQ3T)/(DQ5T))  [also labelled IDP7_RD7]
DP7_RD8: IC12.A6(IO,_DIFFIO_T17n)  [also labelled IDP7_RD8]
DP7_RD9: IC12.B6(IO,_DIFFIO_T17p,_(DATA6),_(DQ3T)/(DQ3T)/(DQ5T))  [also labelled IDP7_RD9]
DP7_TD0: IC12.C13(IO,_DIFFIO_T31n,_(DQ5T)/(DQ3T)/(DQ5T))  [also labelled IDP7_TD0]
DP7_TD1: IC12.D13(IO,_DIFFIO_T31p,_(DQ5T)/(DQ3T)/(DQ5T))  [also labelled IDP7_TD1]
DP7_TD2: IC12.D9(IO,_DIFFIO_T14p,_(DATA8))  [also labelled IDP7_TD2]
DP7_TD3: IC12.E14(IO,_DIFFIO_T26p,_(DQ5T)/(DQ3T)/(DQ5T))  [also labelled IDP7_TD3]
DP7_TD4: IC12.E11(IO,_DIFFIO_T19n,_(DQ3T)/(DQ3T)/(DQ5T))  [also labelled IDP7_TD4]
DP7_TD5: IC12.D10(IO,_DIFFIO_T21p,_(DQ3T)/(DQ3T)/(DQ5T))  [also labelled IDP7_TD5]
DP7_TD6: IC12.C9(IO,_DIFFIO_T14n,_(DQ3T)/(DQ3T)/(DQ5T))  [also labelled IDP7_TD6]
DP7_TD7: IC12.E10(IO)  [also labelled IDP7_TD7]
DP7_TD8: IC12.D12(IO,_DIFFIO_T29p,_(PADD17),_(DQS5T/CQ5T#,DPCLK10)/(DQS5T/CQ5T#,DPCLK10)/(DQS5T/CQ5T#,DPCLK10))  [also labelled IDP7_TD8]
DP7_TD9: IC12.D11(IO,_DIFFIO_T15p)  [also labelled IDP7_TD9]
DP_ENABLE0: IC12.AF7(IO,_DIFFIO_B13n,_(DQ3B)/(DQ3B)/(DQ5B))  [also labelled IDP_ENABLE0]
DP_ENABLE1: IC12.AA3(IO,_DIFFIO_L40n)  [also labelled IDP_ENABLE1]
DP_ENABLE2: IC12.AF11(IO,_DIFFIO_B18n,_(DQS5B/CQ5B#,DPCLK3)/(DQS5B/CQ5B#,DPCLK3)/(DQS5B/CQ5B#,DPCLK3))  [also labelled IDP_ENABLE2]
DP_ENABLE3: IC12.F5(IO,_DIFFIO_L5p,_(DQ2L)/(DQ1L)/(DQ1L))  [also labelled IDP_ENABLE3]
DP_ENABLE4: IC12.V3(IO,_DIFFIO_L31n)  [also labelled IDP_ENABLE4]
DP_ENABLE5: IC12.B3(IO,_DIFFIO_T3n)  [also labelled IDP_ENABLE5]
DP_ENABLE6: IC12.L4(IO,_DIFFIO_L14p)  [also labelled IDP_ENABLE6]
DP_ENABLE7: IC12.D14(IO,_DIFFIO_T30p,_(PADD15))  [also labelled IDP_ENABLE7]
DP_LOOPEN0: IC12.AB8(IO,_DIFFIO_B8n)  [also labelled IDP_LOOPEN0]
DP_LOOPEN1: IC12.T8(IO,_VREFB2N1)  [also labelled IDP_LOOPEN1]
DP_LOOPEN2: IC12.AG12(IO,_DIFFIO_B28p,_(DQ5B)/(DQ3B)/(DQ5B))  [also labelled IDP_LOOPEN2]
DP_LOOPEN3: IC12.E3(IO,_DIFFIO_L4p,_(DQS2L/CQ3L,CDPCLK0)/(DQS2L/CQ3L,CDPCLK0)/(DQS2L/CQ3L,CDPCLK0))  [also labelled IDP_LOOPEN3]
DP_LOOPEN4: IC12.AG3(IO,_DIFFIO_B3n,_(DQ1B)/_/_)  [also labelled IDP_LOOPEN4]
DP_LOOPEN5: IC12.D6(IO,_DIFFIO_T8p,_(DQ1T)/_/_)  [also labelled IDP_LOOPEN5]
DP_LOOPEN6: IC12.U2(IO,_DIFFIO_L30p)  [also labelled IDP_LOOPEN6]
DP_LOOPEN7: IC12.C12(IO,_DIFFIO_T29n,_(PADD16),_(DQ5T)/(DQ3T)/(DQ5T))  [also labelled IDP_LOOPEN7]
DP_PRBSEN0: IC12.V7(IO,_DIFFIO_L43n)  [also labelled IDP_PRBSEN0]
DP_PRBSEN1: IC12.K7(IO,_DIFFIO_L17n)  [also labelled IDP_PRBSEN1]
DP_PRBSEN2: IC12.AC4(IO,_DIFFIO_L49n)  [also labelled IDP_PRBSEN2]
DP_PRBSEN3: IC12.E4(IO,_DIFFIO_T1n)  [also labelled IDP_PRBSEN3]
DP_PRBSEN4: IC12.U4(IO,_DIFFIO_L27n)  [also labelled IDP_PRBSEN4]
DP_PRBSEN5: IC12.G13(IO,_DIFFIO_T22n,_(PADD19))  [also labelled IDP_PRBSEN5]
DP_PRBSEN6: IC12.G4(IO,_DIFFIO_L6p,_(DQ2L)/(DQ1L)/(DQ1L))  [also labelled IDP_PRBSEN6]
DP_PRBSEN7: IC12.A12(IO,_DIFFIO_T27n,_(DQ5T)/(DQ3T)/(DQ5T))  [also labelled IDP_PRBSEN7]
DP_SYNC_PASS0: IC12.Y6(IO,_DIFFIO_L45p)  [also labelled IDP_SYNC_PASS0]
DP_SYNC_PASS1: IC12.J6(IO,_DIFFIO_L16p)  [also labelled IDP_SYNC_PASS1]
DP_SYNC_PASS2: IC12.AC5(IO,_DIFFIO_L49p)  [also labelled IDP_SYNC_PASS2]
DP_SYNC_PASS3: IC12.F1(IO,_DIFFIO_L9n,_(DQ0L)/(DQ1L)/(DQ1L))  [also labelled IDP_SYNC_PASS3]
DP_SYNC_PASS4: IC12.R5(IO,_(DQ1L)/(DQ3L)/(DQ1L))  [also labelled IDP_SYNC_PASS4]
DP_SYNC_PASS5: IC12.G12(IO,_VREFB8N1)  [also labelled IDP_SYNC_PASS5]
DP_SYNC_PASS6: IC12.G5(IO,_DIFFIO_L3n,_(DQ2L)/(DQ1L)/(DQ1L))  [also labelled IDP_SYNC_PASS6]
DP_SYNC_PASS7: IC12.B11(IO,_DIFFIO_T25p,_(DATA3),_(DQ5T)/(DQ3T)/(DQ5T))  [also labelled IDP_SYNC_PASS7]
DP_SYNCEN0: IC12.W7(IO)  [also labelled IDP_SYNCEN0]
DP_SYNCEN1: IC12.J7(IO,_DIFFIO_L17p)  [also labelled IDP_SYNCEN1]
DP_SYNCEN2: IC12.AD3(IO,_DIFFIO_L38n)  [also labelled IDP_SYNCEN2]
DP_SYNCEN3: IC12.E1(IO,_DIFFIO_L8n,__/(DQ1L)/(DQ1L))  [also labelled IDP_SYNCEN3]
DP_SYNCEN4: IC12.R6(IO,_DIFFIO_L26n)  [also labelled IDP_SYNCEN4]
DP_SYNCEN5: IC12.F12(IO,_DIFFIO_T20p,_(DATA13))  [also labelled IDP_SYNCEN5]
DP_SYNCEN6: IC12.G3(IO,_DIFFIO_L6n)  [also labelled IDP_SYNCEN6]
DP_SYNCEN7: IC12.B12(IO,_DIFFIO_T27p)  [also labelled IDP_SYNCEN7]
fclkin_2v5_1: IC12.AG15(CLK13,_DIFFCLK_7p)  [also labelled RBCLK_DP0]
fclkin_2v5_2: IC12.AH15(CLK12,_DIFFCLK_7n)  [also labelled RBCLK_DP1]
fclkin_2v5_3: IC12.Y1(CLK3,_DIFFCLK_1n)  [also labelled RBCLK_DP2]
fclkin_2v5_4: IC12.A14(CLK10,_DIFFCLK_4n)  [also labelled RBCLK_DP3]
fclkin_2v5_5: IC12.B14(CLK11,_DIFFCLK_4p)  [also labelled RBCLK_DP5]
fclkin_2v5_6: IC12.J1(CLK1,_DIFFCLK_0n)  [also labelled RBCLK_DP7]
fclkin_2v5_7: IC12.J2(CLK0,_DIFFCLK_0p)  [also labelled RBCLK_DP6]
fclkin_2v5_8: IC12.Y2(CLK2,_DIFFCLK_1p)  [also labelled RBCLK_DP4]
fclkin_3v3_1: IC12.J28(CLK5,_DIFFCLK_2n) ; port FPGA_REFCLK
fclkin_3v3_2: IC12.J27(CLK4,_DIFFCLK_2p) ; port CPU_CLK
fclkin_3v3_3: IC12.Y27(CLK6,_DIFFCLK_3p) ; port RBCLK_UP1
fclkin_3v3_4: IC12.Y28(CLK7,_DIFFCLK_3n) ; port RBCLK_UP0
fclkin_3v3_5: IC12.A15(CLK8,_DIFFCLK_5n)
FCLKIN_3V3_6: IC12.B15(CLK9,_DIFFCLK_5p)
FREE_2V5_1: IC12.H13(IO,_DIFFIO_T22p,_(DATA15),_(DQ3T)/(DQ3T)/(DQ5T))
FREE_2V5_2: IC12.H14(IO,_DIFFIO_T28n)
FREE_2V5_3: IC12.Y17(IO,_DIFFIO_B51p)
FREE_2V5_4: IC12.J12(IO,_DIFFIO_T24p)
FREE_2V5_5: IC12.F14(IO,_DIFFIO_T26n)
FREE_2V5_6: IC12.AA14(IO,_DIFFIO_B27p)
FREE_2V5_7: IC12.AB13(IO,_VREFB3N0)
FREE_2V5_8: IC12.AB21(IO,_DIFFIO_B57n)
FREE_2V5_9: IC12.C14(IO,_DIFFIO_T30n,_(DQ5T)/(DQ3T)/(DQ5T))
FREE_2V5_10: IC12.AE22(IO,_DIFFIO_B52p)
FREE_2V5_11: IC12.AA16(IO,_DIFFIO_B35p)
FREE_2V5_12: IC12.AB11(IO,_VREFB3N1)
FREE_2V5_13: IC12.AE5(IO,_PLL1_CLKOUTp)
FREE_2V5_14: IC12.AC15(IO,_DIFFIO_B31p,_(DM4B)/(DM5B1/BWS#5B1)/(DM5B1/BWS#5B1))
FREE_2V5_15: IC12.AD25(IO,_DIFFIO_B54p)
FREE_2V5_16: IC12.J10(IO,_DIFFIO_T12p)
FREE_2V5_17: IC12.AA21(IO)
FREE_2V5_18: IC12.Y13(IO,_DIFFIO_B26p)
FREE_2V5_19: IC12.B4(IO,_DIFFIO_T4p,_(DATA12),_(DQS1T/CQ1T#,CDPCLK7)/(DQS1T/CQ1T#,CDPCLK7)/(DQS1T/CQ1T#,CDPCLK7))
FREE_2V5_20: IC12.AA13(IO,_DIFFIO_B26n)
FREE_2V5_21: IC12.G14(IO,_VREFB8N0)
free_2v5_22: IC12.G11(IO,_DIFFIO_T16n)
FREE_2V5_23: IC12.U5(IO,_DIFFIO_L35n)
FREE_2V5_24: IC12.J3(IO,_DIFFIO_L10n,_(DQ0L)/(DQ1L)/(DQ1L))
FREE_2V5_25: IC12.AA10(IO,_DIFFIO_B11n,_(DQ3B)/(DQ3B)/(DQ5B))
FREE_2V5_26: IC12.AC14(IO,_DIFFIO_B29p)
FREE_2V5_27: IC12.AB18(IO,_DIFFIO_B53n)
free_2v5_28: IC12.G10(IO,_DIFFIO_T13p)
free_2v5_29: IC12.H10(IO,_DIFFIO_T12n)
FREE_2V5_30: IC12.AA7(IO)
FREE_2V5_31: IC12.J13(IO,_DIFFIO_T24n)
FREE_2V5_32: IC12.AB22(IO,_DIFFIO_B57p)
FREE_2V5_33: IC12.W3(IO,_DIFFIO_L44n)
FREE_2V5_34: IC12.A3(IO,_DIFFIO_T3p,_(DQ1T)/_/_)
FREE_2V5_35: IC12.Y16(IO,_DIFFIO_B51n)
FREE_2V5_36: IC12.AE4(IO,_DIFFIO_B3p)
FREE_2V5_37: IC12.AA15(IO,_VREFB4N2)
FREE_2V5_38: IC12.A4(IO,_DIFFIO_T4n,_(DQ1T)/_/_)
FREE_2V5_39: IC12.L8(IO,_DIFFIO_L18n)
FREE_2V5_40: IC12.L7(IO,_DIFFIO_L19p)
FREE_2V5_41: IC12.AF3(IO,_DIFFIO_B4n)
free_2v5_42: IC12.H8(IO,_DIFFIO_T6p)
FREE_2V5_43: IC12.Y10(IO,_VREFB3N2)
FREE_2V5_44: IC12.Y19(IO,_DIFFIO_B56p)
FREE_2V5_45: IC12.Y14(IO,_DIFFIO_B30p)
FREE_2V5_46: IC12.AF4(IO,_DIFFIO_B2n,_(DQ1B)/_/_)
FREE_2V5_47: IC12.L3(IO,_DIFFIO_L14n)
FREE_2V5_48: IC12.AB12(IO,_DIFFIO_B22n)
FREE_2V5_49: IC12.AA8(IO,_DIFFIO_B11p)
FREE_2V5_50: IC12.E7(IO,_DIFFIO_T8n)
FREE_2V5_51: IC12.V5(IO,_DIFFIO_L42n)
FREE_2V5_52: IC12.AA12(IO,_DIFFIO_B25n)
FREE_2V5_53: IC12.AA17(IO,_RUP2)
FREE_2V5_54: IC12.AB14(IO,_DIFFIO_B27n)
FREE_2V5_55: IC12.AB15(IO)
FREE_3V3_3: IC12.N21(IO,_VREFB6N2)
free_3v3_4: IC12.Y23(IO,_DIFFIO_R46p)
FREE_3V3_5: IC12.H21(IO,_DIFFIO_T41n)
FREE_3V3_6: IC12.R26(IO,_DIFFIO_R28n,_(DQ1R)/(DQ3R)/(DQ1R))
FREE_3V3_7: IC12.B25(IO,_(DQ0T)/_/_)
FREE_3V3_8: IC12.N25(IO,_DIFFIO_R22p)
free_3v3_9: IC12.V21(IO,_DIFFIO_R35p)
free_3v3_10: IC12.V22(IO,_DIFFIO_R34n)
FREE_3V3_11: IC12.L22(IO,_DIFFIO_R7n)
free_3v3_12: IC12.U21(IO)
FREE_3V3_13: IC12.Y26(IO,_DIFFIO_R41n,_(DQ1R)/(DQ3R)/(DQ1R))
FREE_3V3_14: IC12.T21(IO,_DIFFIO_R29p,_(DEV_CLRn))
FREE_3V3_15: IC12.G23(IO,_DIFFIO_R1p)
FREE_3V3_16: IC12.J26(IO,_DIFFIO_R16n)
FREE_3V3_17: IC12.L21(IO,_DIFFIO_R7p)
free_3v3_18: IC12.P21(IO,_DIFFIO_R25p)
FREE_3V3_19: IC12.H19(IO,_DIFFIO_T42n)
FREE_3V3_20: IC12.N26(IO,_DIFFIO_R22n,_(DQS0R/CQ1R,DPCLK7)/(DQS0R/CQ1R,DPCLK7)/(DQS0R/CQ1R,DPCLK7))
FREE_3V3_21: IC12.J22(IO,_VREFB6N0)
FREE_3V3_22: IC12.G22(IO,_DIFFIO_T41p)
free_3v3_23: IC12.J19(IO,_DIFFIO_T42p)
GPIO0: IC12.G24(IO,_DIFFIO_R1n)  [also labelled IGPIO0]  [project net FP_FPGALEDA0]
GPIO1: IC12.L23(IO,_DIFFIO_R18p)  [also labelled IGPIO1]  [project net FP_FPGALEDB0]
GPIO2: IC12.K22(IO,_DIFFIO_R5n)  [also labelled IGPIO2]  [project net FP_FPGALEDA1]
GPIO3: IC12.J23(IO,_DIFFIO_R6p)  [also labelled IGPIO3]  [project net FP_FPGALEDB1]
GPIO4: IC12.H23(IO,_DIFFIO_R4p)  [also labelled IGPIO4]  [project net FP_FPGALEDA2]
GPIO5: IC12.M23(IO)  [also labelled IGPIO5]  [project net FP_FPGALEDB2]
GPIO6: IC12.M21(IO,_VREFB6N1)  [also labelled IGPIO6]  [project net FP_FPGALEDA3]
GPIO7: IC12.K21(IO,_DIFFIO_R5p)  [also labelled IGPIO7]  [project net FP_FPGALEDB3]
IMCH_UPD_RX: IC12.W21(IO,_DIFFIO_R35n) ; port MCH_UPD_RX  [also labelled MCH_UPD_RX]
IMCH_UPD_TX: IC12.Y22(IO,_DIFFIO_R31n) ; port MCH_UPD_TX  [also labelled MCH_UPD_TX]
InRST: IC12.V24(IO,_DIFFIO_R36n) ; port nRST  [also labelled nRST]
IPPS_IN: IC12.AC27(IO,_DIFFIO_R45p,_(DQ3R)/(DQ3R)/(DQ1R)) ; port PPS_IN  [also labelled PPS_IN]
IPPS_OUT: IC12.AD27(IO,_DIFFIO_R47p,_(DQ3R)/(DQ3R)/(DQ1R)) ; port PPS_OUT  [also labelled PPS_OUT]
ISMI_RX0: IC12.F17(IO,_DIFFIO_T38n)  [also labelled SMI_RX0]
ISMI_RX1: IC12.F18(IO,_DIFFIO_T51p)  [also labelled SMI_RX1]
ISMI_RX2: IC12.G18(IO,_DIFFIO_T40p)  [also labelled SMI_RX2]
ISMI_RX3: IC12.E19(IO,_RDN4)  [also labelled SMI_RX3]
ISMI_RX4: IC12.F21(IO,_DIFFIO_T58p,_(DQ0T)/_/_)  [also labelled SMI_RX4]
ISMI_RX5: IC12.G20(IO,_DIFFIO_T43n)  [also labelled SMI_RX5]
ISMI_RX6: IC12.G19(IO,_DIFFIO_T40n)  [also labelled SMI_RX6]
ISMI_RX7: IC12.F19(IO,_RUP4)  [also labelled SMI_RX7]
ISMI_TX0: IC12.H15(IO,_DIFFIO_T34n)  [also labelled SMI_TX0]
ISMI_TX1: IC12.J16(IO,_DIFFIO_T37n)  [also labelled SMI_TX1]
ISMI_TX2: IC12.J17(IO)  [also labelled SMI_TX2]
ISMI_TX3: IC12.J15(IO,_DIFFIO_T34p)  [also labelled SMI_TX3]
ISMI_TX4: IC12.H17(IO,_DIFFIO_T39p)  [also labelled SMI_TX4]
ISMI_TX5: IC12.G17(IO,_VREFB7N1)  [also labelled SMI_TX5]
ISMI_TX6: IC12.G16(IO,_DIFFIO_T39n)  [also labelled SMI_TX6]
ISMI_TX7: IC12.H16(IO,_DIFFIO_T37p)  [also labelled SMI_TX7]
IUP0_RD0: IC12.AB19(IO,_DIFFIO_B53p)  [also labelled UP0_RD0]
IUP0_RD1: IC12.AC19(IO,_DIFFIO_B50p)  [also labelled UP0_RD1]
IUP0_RD2: IC12.AC18(IO,_VREFB4N1)  [also labelled UP0_RD2]
IUP0_RD3: IC12.AC17(IO,_DIFFIO_B39p)  [also labelled UP0_RD3]
IUP0_RD4: IC12.AB16(IO,_DIFFIO_B35n,_(DQ4B)/(DQ5B)/(DQ5B))  [also labelled UP0_RD4]
IUP0_RD5: IC12.AE21(IO,_DIFFIO_B47p,_(DQ0B)/_/_)  [also labelled UP0_RD5]
IUP0_RD6: IC12.AF21(IO,_DIFFIO_B47n)  [also labelled UP0_RD6]
IUP0_RD7: IC12.AF22(IO,_DIFFIO_B52n,_(DQ0B)/_/_)  [also labelled UP0_RD7]
IUP0_RD8: IC12.AE20(IO,_DIFFIO_B46p)  [also labelled UP0_RD8]
IUP0_RD9: IC12.AF20(IO,_DIFFIO_B46n,_(DQ0B)/_/_)  [also labelled UP0_RD9]
IUP0_TD0: IC12.AH17(IO,_DIFFIO_B33n,_(DQ4B)/(DQ5B)/(DQ5B)) RP11.8(B)
IUP0_TD1: IC12.AG17(IO,_DIFFIO_B33p,_(DQ4B)/(DQ5B)/(DQ5B)) RP11.7(B)
IUP0_TD2: IC12.AH18(IO,_DIFFIO_B37n,_(DQ4B)/(DQ5B)/(DQ5B)) RP11.6(B)
IUP0_TD3: IC12.AG18(IO,_DIFFIO_B37p,_(DQ4B)/(DQ5B)/(DQ5B)) RP11.5(B)
IUP0_TD4: IC12.AH19(IO,_DIFFIO_B38n,_(DM2B)/(DM5B0/BWS#5B0)/(DM5B0/BWS#5B0)) RP13.8(B)
IUP0_TD5: IC12.AG19(IO,_DIFFIO_B38p) RP13.7(B)
IUP0_TD6: IC12.AH21(IO,_DIFFIO_B40n,_(DQ2B)/(DQ5B)/(DQ5B)) RP13.6(B)
IUP0_TD7: IC12.AG21(IO,_DIFFIO_B40p,_(DQ2B)/(DQ5B)/(DQ5B)) RP13.5(B)
IUP0_TD8: IC12.AG22(IO,_DIFFIO_B42p,_(DQ2B)/(DQ5B)/(DQ5B)) RP16.7(B)
IUP0_TD9: IC12.AH22(IO,_DIFFIO_B42n,_(DQ2B)/(DQ5B)/(DQ5B)) RP16.8(B)
IUP1_RD0: IC12.AG26(IO,_DIFFIO_B59p,_(DQ0B)/_/_)  [also labelled UP1_RD0]
IUP1_RD1: IC12.AH26(IO,_DIFFIO_B59n)  [also labelled UP1_RD1]
IUP1_RD2: IC12.AF19(IO,_DIFFIO_B44n)  [also labelled UP1_RD2]
IUP1_RD3: IC12.AE19(IO,_DIFFIO_B44p,_(DQ2B)/(DQ5B)/(DQ5B))  [also labelled UP1_RD3]
IUP1_RD4: IC12.AD21(IO,_DIFFIO_B55n)  [also labelled UP1_RD4]
IUP1_RD5: IC12.AD19(IO,_DIFFIO_B50n)  [also labelled UP1_RD5]
IUP1_RD6: IC12.AF18(IO,_DIFFIO_B41n)  [also labelled UP1_RD6]
IUP1_RD7: IC12.AE18(IO,_DIFFIO_B41p,_(DQS2B/CQ3B,DPCLK5)/(DQS2B/CQ3B,DPCLK5)/(DQS2B/CQ3B,DPCLK5))  [also labelled UP1_RD7]
IUP1_RD8: IC12.AD18(IO,_(DQ0B)/_/_)  [also labelled UP1_RD8]
IUP1_RD9: IC12.AF17(IO,_DIFFIO_B36n,_(DQS4B/CQ5B,DPCLK4)/(DQS4B/CQ5B,DPCLK4)/(DQS4B/CQ5B,DPCLK4))  [also labelled UP1_RD9]
IUP1_TD0: IC12.AE11(IO,_DIFFIO_B18p,_(DQ5B)/(DQ3B)/(DQ5B)) RP12.5(B)
IUP1_TD1: IC12.AF12(IO,_DIFFIO_B17n) RP12.6(B)
IUP1_TD2: IC12.AE12(IO,_DIFFIO_B17p,_(DQ5B)/(DQ3B)/(DQ5B)) RP12.7(B)
IUP1_TD3: IC12.AD12(IO) RP12.8(B)
IUP1_TD4: IC12.AF13(IO,_DIFFIO_B21n) RP14.5(B)
IUP1_TD5: IC12.AE13(IO,_DIFFIO_B21p,_(DQ5B)/(DQ3B)/(DQ5B)) RP14.6(B)
IUP1_TD6: IC12.AF14(IO,_DIFFIO_B23n) RP14.7(B)
IUP1_TD7: IC12.AE14(IO,_DIFFIO_B23p) RP14.8(B)
IUP1_TD8: IC12.AD14(IO,_DIFFIO_B29n) RP17.7(B)
IUP1_TD9: IC12.AD15(IO,_DIFFIO_B31n) RP17.8(B)
IUP_ENABLE0: IC12.AH23(IO,_DIFFIO_B43n,_(DQ2B)/(DQ5B)/(DQ5B)) RP10.4(A)  [also labelled UP_ENABLE0]
IUP_ENABLE1: IC12.AD17(IO,_DIFFIO_B39n,_(DQ2B)/(DQ5B)/(DQ5B)) RP15.2(A)  [also labelled UP_ENABLE1]
IUP_LOOPEN0: IC12.AH25(IO,_DIFFIO_B49n,_(DQ0B)/_/_) RP10.2(A)  [also labelled UP_LOOPEN0]
IUP_LOOPEN1: IC12.AF16(IO,_DIFFIO_B34n,_(DQ4B)/(DQ5B)/(DQ5B)) RP15.4(A)  [also labelled UP_LOOPEN1]
IUP_PRBSEN0: IC12.AG25(IO,_DIFFIO_B49p) RP10.1(A)  [also labelled UP_PRBSEN0]
IUP_PRBSEN1: IC12.AF15(IO,_DIFFIO_B32n,_(DQ4B)/(DQ5B)/(DQ5B)) RP15.1(A)  [also labelled UP_PRBSEN1]
IUP_SFP_DETECT0: IC12.AB26(IO,_DIFFIO_R44n,_(DQ3R)/(DQ3R)/(DQ1R)) ; port UP_SFP_DETECT0  [also labelled UP_SFP_DETECT0]
IUP_SFP_DETECT1: IC12.AC24(IO,_DIFFIO_R51p) ; port UP_SFP_DETECT1  [also labelled UP_SFP_DETECT1]
IUP_SFP_LOS0: IC12.AB24(IO,_(DM3R/BWS#3R)/(DM3R1/BWS#3R1)/(DM1R3/BWS#1R3)) ; port UP_SFP_LOS0  [also labelled UP_SFP_LOS0]
IUP_SFP_LOS1: IC12.AE26(IO,_DIFFIO_R50p) ; port UP_SFP_LOS1  [also labelled UP_SFP_LOS1]
IUP_SFP_SCL0: IC12.AD28(IO,_DIFFIO_R47n,_(DQ3R)/(DQ3R)/(DQ1R)) RP26.3(A)  [also labelled UP_SFP_SCL0]
IUP_SFP_SCL1: IC12.AC25(IO,_DIFFIO_R51n) RP27.3(A)  [also labelled UP_SFP_SCL1]
IUP_SFP_SDA0: IC12.AE28(IO,_DIFFIO_R48n,_(DQ3R)/(DQ3R)/(DQ1R)) RP26.2(A)  [also labelled UP_SFP_SDA0]
IUP_SFP_SDA1: IC12.AC26(IO,_DIFFIO_R49p) RP27.2(A)  [also labelled UP_SFP_SDA1]
IUP_SFP_TX_DISABLE0: IC12.AE27(IO,_DIFFIO_R48p) RP26.1(A)  [also labelled UP_SFP_TX_DISABLE0]
IUP_SFP_TX_DISABLE1: IC12.AB23(IO,_RDN3) RP27.1(A)  [also labelled UP_SFP_TX_DISABLE1]
IUP_SFP_TX_FAULT0: IC12.AB25(IO,_DIFFIO_R44p) ; port UP_SFP_TX_FAULT0  [also labelled UP_SFP_TX_FAULT0]
IUP_SFP_TX_FAULT1: IC12.AD26(IO,_DIFFIO_R49n,_(DQ3R)/(DQ3R)/(DQ1R)) ; port UP_SFP_TX_FAULT1  [also labelled UP_SFP_TX_FAULT1]
IUP_SYNC_PASS0: IC12.AE17(IO,_DIFFIO_B36p,_(DQ4B)/(DQ5B)/(DQ5B)) ; port UP_SYNC_PASS0  [also labelled UP_SYNC_PASS0]
IUP_SYNC_PASS1: IC12.AE15(IO,_DIFFIO_B32p,__/(DQ5B)/(DQ5B)) ; port UP_SYNC_PASS1  [also labelled UP_SYNC_PASS1]
IUP_SYNCEN0: IC12.AG23(IO,_DIFFIO_B43p) RP10.3(A)  [also labelled UP_SYNCEN0]
IUP_SYNCEN1: IC12.AE16(IO,_DIFFIO_B34p) RP15.3(A)  [also labelled UP_SYNCEN1]
IWD_IN: IC12.G21(IO,_DIFFIO_T43p) ; port WD_IN  [also labelled WD_IN]
IWD_OUT: IC12.F22(IO,_VREFB7N0) ; port WD_OUT  [also labelled WD_OUT]
IZBT_A0: IC12.G25(IO,_DIFFIO_R3p)  [also labelled ZBT_A0]
IZBT_A1: IC12.G27(IO,_DIFFIO_R15p,_(nOE),_(DQ2R)/(DQ1R)/(DQ1R))  [also labelled ZBT_A1]
IZBT_A2: IC12.G28(IO,_DIFFIO_R15n,_(nWE),_(DQ2R)/(DQ1R)/(DQ1R))  [also labelled ZBT_A2]
IZBT_A3: IC12.E28(IO,_DIFFIO_R12n,_(PADD23),_(DQ2R)/(DQ1R)/(DQ1R))  [also labelled ZBT_A3]
IZBT_A4: IC12.E27(IO,_DIFFIO_R12p,_(DQ2R)/(DQ1R)/(DQ1R))  [also labelled ZBT_A4]
IZBT_A5: IC12.F28(IO,_DIFFIO_R13n,_(nAVD),_(DQ2R)/(DQ1R)/(DQ1R))  [also labelled ZBT_A5]
IZBT_A6: IC12.F15(IO,_DIFFIO_T33n)  [also labelled ZBT_A6]
IZBT_A7: IC12.E15(IO,_DIFFIO_T33p,_(DM4T)/(DM5T1/BWS#5T1)/(DM5T1/BWS#5T1))  [also labelled ZBT_A7]
IZBT_A8: IC12.D18(IO,_DIFFIO_T50p,_(PADD2))  [also labelled ZBT_A8]
IZBT_A9: IC12.E18(IO,_DIFFIO_T51n,_(DQ2T)/(DQ5T)/(DQ5T))  [also labelled ZBT_A9]
IZBT_A10: IC12.F26(IO,_DIFFIO_R10p,_(DQ2R)/(DQ1R)/(DQ1R))  [also labelled ZBT_A10]
IZBT_A11: IC12.E26(IO,_DIFFIO_R10n)  [also labelled ZBT_A11]
IZBT_A12: IC12.F25(IO,_DIFFIO_R2n)  [also labelled ZBT_A12]
IZBT_A13: IC12.E25(IO,_DIFFIO_T48p)  [also labelled ZBT_A13]
IZBT_A14: IC12.F24(IO,_DIFFIO_R2p)  [also labelled ZBT_A14]
IZBT_A15: IC12.D26(IO,_DIFFIO_R8p)  [also labelled ZBT_A15]
IZBT_A16: IC12.C26(IO,_DIFFIO_T61n)  [also labelled ZBT_A16]
IZBT_ADV/LD: IC12.C18(IO,_DIFFIO_T50n,_(PADD1),__/(DQ5T)/(DQ5T)) ; port ZBT_ADV/LD  [also labelled ZBT_ADV/LD]
IZBT_BW1: IC12.D16(IO,_DIFFIO_T36p,_(PADD10))  [also labelled ZBT_BW1]
IZBT_BW2: IC12.C16(IO,_DIFFIO_T36n,_(PADD9),_(DQ4T)/(DQ5T)/(DQ5T))  [also labelled ZBT_BW2]
IZBT_BW3: IC12.D15(IO,_DIFFIO_T32p,_(PADD14),_(DQ5T)/(DQ3T)/(DQ5T))  [also labelled ZBT_BW3]
IZBT_BW4: IC12.C15(IO,_DIFFIO_T32n,_(PADD13))  [also labelled ZBT_BW4]
IZBT_CEN: IC12.C17(IO,_DIFFIO_T46n,_(PADD3),_(DQ4T)/(DQ5T)/(DQ5T)) ; port ZBT_CEN  [also labelled ZBT_CEN]
IZBT_IO0: IC12.C25(IO,_DIFFIO_T57p,_(DQ0T)/_/_)  [also labelled ZBT_IO0]
IZBT_IO1: IC12.E24(IO,_DIFFIO_T48n)  [also labelled ZBT_IO1]
IZBT_IO2: IC12.D24(IO,_DIFFIO_T55p)  [also labelled ZBT_IO2]
IZBT_IO3: IC12.C24(IO,_DIFFIO_T55n,_(DQ2T)/(DQ5T)/(DQ5T))  [also labelled ZBT_IO3]
IZBT_IO4: IC12.D23(IO,_PLL2_CLKOUTp)  [also labelled ZBT_IO4]
IZBT_IO5: IC12.C23(IO,_PLL2_CLKOUTn)  [also labelled ZBT_IO5]
IZBT_IO6: IC12.E22(IO,_DIFFIO_T60p,_(DQ0T)/_/_)  [also labelled ZBT_IO6]
IZBT_IO7: IC12.D22(IO,_DIFFIO_T60n,_(DQ0T)/_/_)  [also labelled ZBT_IO7]
IZBT_IO8: IC12.C22(IO,_DIFFIO_T54n,_(DQ2T)/(DQ5T)/(DQ5T))  [also labelled ZBT_IO8]
IZBT_IO9: IC12.D21(IO,_DIFFIO_T54p,_(DQ2T)/(DQ5T)/(DQ5T))  [also labelled ZBT_IO9]
IZBT_IO10: IC12.G15(IO,_VREFB7N2)  [also labelled ZBT_IO10]
IZBT_IO11: IC12.C21(IO,_(DQ2T)/(DQ5T)/(DQ5T))  [also labelled ZBT_IO11]
IZBT_IO12: IC12.E21(IO,_DIFFIO_T58n)  [also labelled ZBT_IO12]
IZBT_IO13: IC12.D20(IO,_DIFFIO_T49p,_(DQ4T)/(DQ5T)/(DQ5T))  [also labelled ZBT_IO13]
IZBT_IO14: IC12.C20(IO,_DIFFIO_T49n,_(DM2T)/(DM5T0/BWS#5T0)/(DM5T0/BWS#5T0))  [also labelled ZBT_IO14]
IZBT_IO15: IC12.D19(IO,_DIFFIO_T47p)  [also labelled ZBT_IO15]
IZBT_IO16: IC12.A17(IO,_DIFFIO_T35n,_(PADD11),__/(DQ5T)/(DQ5T))  [also labelled ZBT_IO16]
IZBT_IO17: IC12.B18(IO,_DIFFIO_T44p,_(PADD8),_(DQ4T)/(DQ5T)/(DQ5T))  [also labelled ZBT_IO17]
IZBT_IO18: IC12.A18(IO,_DIFFIO_T44n,_(PADD7))  [also labelled ZBT_IO18]
IZBT_IO19: IC12.B19(IO,_DIFFIO_T45p,_(PADD6),_(DQ4T)/(DQ5T)/(DQ5T))  [also labelled ZBT_IO19]
IZBT_IO20: IC12.A19(IO,_DIFFIO_T45n,_(PADD5),_(DQ4T)/(DQ5T)/(DQ5T))  [also labelled ZBT_IO20]
IZBT_IO21: IC12.B21(IO,_DIFFIO_T52p,_(DQ2T)/(DQ5T)/(DQ5T))  [also labelled ZBT_IO21]
IZBT_IO22: IC12.A21(IO,_DIFFIO_T52n,_(DQ2T)/(DQ5T)/(DQ5T))  [also labelled ZBT_IO22]
IZBT_IO23: IC12.B22(IO,_DIFFIO_T53p,_(PADD0))  [also labelled ZBT_IO23]
IZBT_IO24: IC12.A22(IO,_DIFFIO_T53n,_(DQ2T)/(DQ5T)/(DQ5T))  [also labelled ZBT_IO24]
IZBT_IO25: IC12.B23(IO,_DIFFIO_T56p,_(DM0T)/_/_)  [also labelled ZBT_IO25]
IZBT_IO26: IC12.A23(IO,_DIFFIO_T56n,_(DQ0T)/_/_)  [also labelled ZBT_IO26]
IZBT_IO27: IC12.A25(IO,_DIFFIO_T59p,_(DQS0T/CQ1T,CDPCLK6)/(DQS0T/CQ1T,CDPCLK6)/(DQS0T/CQ1T,CDPCLK6))  [also labelled ZBT_IO27]
IZBT_IO28: IC12.B26(IO,_DIFFIO_T61p,_(DQ0T)/_/_)  [also labelled ZBT_IO28]
IZBT_IO29: IC12.A26(IO,_DIFFIO_T59n,_(DQ0T)/_/_)  [also labelled ZBT_IO29]
IZBT_IO30: IC12.C27(IO,_DIFFIO_R8n,_(PADD20),_(DQS2R/CQ3R,CDPCLK5)/(DQS2R/CQ3R,CDPCLK5)/(DQS2R/CQ3R,CDPCLK5))  [also labelled ZBT_IO30]
IZBT_IO31: IC12.D28(IO,_DIFFIO_R9n,_(PADD22))  [also labelled ZBT_IO31]
IZBT_IOP1: IC12.D25(IO,_DIFFIO_T57n)  [also labelled ZBT_IOP1]
IZBT_IOP2: IC12.C19(IO,_DIFFIO_T47n,_(DQ4T)/(DQ5T)/(DQ5T))  [also labelled ZBT_IOP2]
IZBT_IOP3: IC12.B17(IO,_DIFFIO_T35p,_(PADD12),_(DQS4T/CQ5T,DPCLK9)/(DQS4T/CQ5T,DPCLK9)/(DQS4T/CQ5T,DPCLK9))  [also labelled ZBT_IOP3]
IZBT_IOP4: IC12.D27(IO,_DIFFIO_R9p,_(PADD21),_(DQ2R)/(DQ1R)/(DQ1R))  [also labelled ZBT_IOP4]
IZBT_LBO: IC12.F27(IO,_DIFFIO_R13p,_(RDY)) ; port ZBT_LBO  [also labelled ZBT_LBO]
IZBT_OE: IC12.D17(IO,_DIFFIO_T46p,_(PADD4),_(DQS2T/CQ3T,DPCLK8)/(DQS2T/CQ3T,DPCLK8)/(DQS2T/CQ3T,DPCLK8)) ; port ZBT_OE  [also labelled ZBT_OE]
IZBT_RW: IC12.E17(IO,_DIFFIO_T38p,_(DQ4T)/(DQ5T)/(DQ5T)) ; port ZBT_RW  [also labelled ZBT_RW]
MAIN_FPGA_DIN: IC12.N7(IO,_(DATA0)) ; port FPGA_CONF_DIN
UP0_TD0: RP11.1(A)
UP0_TD1: RP11.2(A)
UP0_TD2: RP11.3(A)
UP0_TD3: RP11.4(A)
UP0_TD4: RP13.1(A)
UP0_TD5: RP13.2(A)
UP0_TD6: RP13.3(A)
UP0_TD7: RP13.4(A)
UP0_TD8: RP16.2(A)
UP0_TD9: RP16.1(A)
UP1_TD0: RP12.4(A)
UP1_TD1: RP12.3(A)
UP1_TD2: RP12.2(A)
UP1_TD3: RP12.1(A)
UP1_TD4: RP14.4(A)
UP1_TD5: RP14.3(A)
UP1_TD6: RP14.2(A)
UP1_TD7: RP14.1(A)
UP1_TD8: RP17.2(A)
UP1_TD9: RP17.1(A)
UP_ENABLE0: RP10.5(B) ; port UP_ENABLE0
UP_ENABLE1: RP15.7(B) ; port UP_ENABLE1
UP_LOOPEN0: RP10.7(B) ; port UP_LOOPEN0
UP_LOOPEN1: RP15.5(B) ; port UP_LOOPEN1
UP_PRBSEN0: RP10.8(B) ; port UP_PRBSEN0
UP_PRBSEN1: RP15.8(B) ; port UP_PRBSEN1
UP_SFP_SCL0: RP26.6(B) ; port UP_SFP_SCL0
UP_SFP_SCL1: RP27.6(B) ; port UP_SFP_SCL1
UP_SFP_SDA0: RP26.7(B) ; port UP_SFP_SDA0
UP_SFP_SDA1: RP27.7(B) ; port UP_SFP_SDA1
UP_SFP_TX_DISABLE0: RP26.8(B) ; port UP_SFP_TX_DISABLE0
UP_SFP_TX_DISABLE1: RP27.8(B) ; port UP_SFP_TX_DISABLE1
UP_SYNCEN0: RP10.6(B) ; port UP_SYNCEN0
UP_SYNCEN1: RP15.6(B) ; port UP_SYNCEN1

Not connected (* = marked no-connect by the designer): IC12 AF27(IO,_DIFFIO_R50n,_(DQS3R/CQ3R#,CDPCLK4)/(DQS3R/CQ3R#,CDPCLK4)/(DQS3R/CQ3R#,CDPCLK4))* H22(IO)*; RP16 3(A) 4(A) 5(B) 6(B); RP17 3(A) 4(A) 5(B) 6(B); RP26 4(A) 5(B); RP27 4(A) 5(B)

### Buses and harness runs
bus AUX[0..7] = port AUX[0..7]
bus CMI_PIO[0..3] = port CMI_PIO[0..3]
bus CPU_A[0..20] = port CPU_A[0..20]
bus CPU_D[0..31] = port CPU_D[0..31]
bus DP0_RD[0..9] = port DP0_RD[0..9]
bus DP0_TD[0..9] = port DP0_TD[0..9]
bus DP1_RD[0..9] = port DP1_RD[0..9]
bus DP1_TD[0..9] = port DP1_TD[0..9]
bus DP2_RD[0..9] = port DP2_RD[0..9]
bus DP2_TD[0..9] = port DP2_TD[0..9]
bus DP3_RD[0..9] = port DP3_RD[0..9]
bus DP3_TD[0..9] = port DP3_TD[0..9]
bus DP4_RD[0..9] = port DP4_RD[0..9]
bus DP4_TD[0..9] = port DP4_TD[0..9]
bus DP5_RD[0..9] = port DP5_RD[0..9]
bus DP5_TD[0..9] = port DP5_TD[0..9]
bus DP6_RD[0..9] = port DP6_RD[0..9]
bus DP6_TD[0..9] = port DP6_TD[0..9]
bus DP7_RD[0..9] = port DP7_RD[0..9]
bus DP7_TD[0..9] = port DP7_TD[0..9]
bus DP_ENABLE[0..7] = port DP_ENABLE[0..7]
bus DP_LOOPEN[0..7] = port DP_LOOPEN[0..7]
bus DP_PRBSEN[0..7] = port DP_PRBSEN[0..7]
bus DP_SYNC_PASS[0..7] = port DP_SYNC_PASS[0..7]
bus DP_SYNCEN[0..7] = port DP_SYNCEN[0..7]
bus GPIO[0..7] = port GPIO[0..7]
bus RBCLK_DP[0..7] = port RBCLK_DP[0..7]
bus SMI_RX[0..7] = port SMI_RX[0..7]
bus SMI_TX[0..7] = port SMI_TX[0..7]
bus UP0_RD[0..9] = port UP0_RD[0..9]
bus UP0_TD[0..9] = port UP0_TD[0..9]
bus UP1_RD[0..9] = port UP1_RD[0..9]
bus UP1_TD[0..9] = port UP1_TD[0..9]
bus ZBT_A[0..16] = port ZBT_A[0..16]
bus ZBT_BW[1..4] = port ZBT_BW[1..4]
bus ZBT_IO[0..31] = port ZBT_IO[0..31]
bus ZBT_IOP[1..4] = port ZBT_IOP[1..4]

### Notes on the sheet
- DOWNLINK TX/RX
- (near RP11) UPLINK TX/RX
- 2.5 V PORTS
- (near RP15) UPLINK CONTROL
- SWITCH MANAGEMENT (SMI) I/F
- CPU I/F
- 3.3 V PORTS
- UPLINK SFP CONTROL
- CLOCK MODULE I/F (CMI)
- GPIO AND AUXILLARY SIGNALS
- DOWNLINK CONTROL
- ZBT MEMORY I/F
- 2.5 V
- 3.3 V
- White Rabbit Switch MCH - mainboard
- Main BIGGGG FPGA!
- (in symbol EP3C120F780C7, part A) BANK 1
- (in symbol EP3C120F780C7, part B) BANK 2
- (in symbol EP3C120F780C7, part C) BANK 3
- (in symbol EP3C120F780C7, part D) BANK 4
- (in symbol EP3C120F780C7, part E) BANK 5
- (in symbol EP3C120F780C7, part F) BANK 6
- (in symbol EP3C120F780C7, part G) BANK 7
- (in symbol EP3C120F780C7, part H) BANK 8
- (in symbol R0402_100R_1%_0.0625W_100PPM) 1%

### Library data of the parts
IC12 = EP3C120F780C7: Cyclone III Family FPGA, 531 I/O Pins, 4 PLLs, 780-Pin FBGA, Speed Grade 7, Commercial Grade; Value: EP3C120F780C8N; RefId: 1635080; Published: 26-Feb-2007; DatasheetVersion: ver1.2, Sep-2007; PackageVersion: ver14.8, Oct-2007; PackageReference: FBGA780-2; Publisher: Altium Limited; PackageDescription: 780-Ball FineLine Ball Grid Array (FBGA780) - Option 2 - Wire Bond; Code_JEDEC: MS-034-AAM-1; ComponentLink1Description: Manufacturer Link; ComponentLink1URL: http://www.altera.com/; ComponentLink2Description: Handbook (7.86MB); ComponentLink2URL: http://www.altera.com/literature/hb/cyc3/cyclone3_handbook.pdf; ComponentLink3Description: Packaging Specification; ComponentLink3URL: http://www.altera.com/literature/ds/dspkg.pdf; Supplier: Farnell
R101 = R0402_100R_1%_0.0625W_100PPM: Resistor - 1%; Part Description: General Purpose Thick Film Chip Resistor; Manufacturer: GENERIC; Manufacturer1 Part Number: 232270671001; Manufacturer1 Datasheet: \\cern.ch\dfs\Applications\Altium\Datasheets\R0402_Phycomp_RC0402.pdf; TC: ±100ppm/°C; Table: Resistors SMD; Part Number: R0402_100R_1%_0.0625W_100PPM; Component Kind: Standard; Component Type: Standard; Designator: Resistor - 1%; Library Reference: Resistor - 1%; Pin Count: 2; Value: 100; Status: Not recommended; Power: 0.0625W; Tolerance: ±1%; Manufacturer Part Number: R0402_100R_1%_0.0625W_100PPM; Case: 0402; Mounted: Yes; Socket: No; SMD: Yes; Manufacturer1 Example: PHYCOMP; Manufacturer1 ComponentHeight: 0.4mm; HelpURL: \\cern.ch\dfs\Applications\Altium\Datasheets\R0402_Phycomp_RC0402.pdf; Author: CERN DEM JLC; CreateDate: 12/3/2007; LatestRevisionDate: 3/13/2008
RP10-RP17 RP26 RP27 = Res_Pack4_22R_YC124: 4-resistor pack; RefId: AVX  CRB2A4 series; Supplier: Farnell